# EAGLE design senseBox-MCU_v11 (EAGLE 7.7.0)

## Sheet 1 of 4
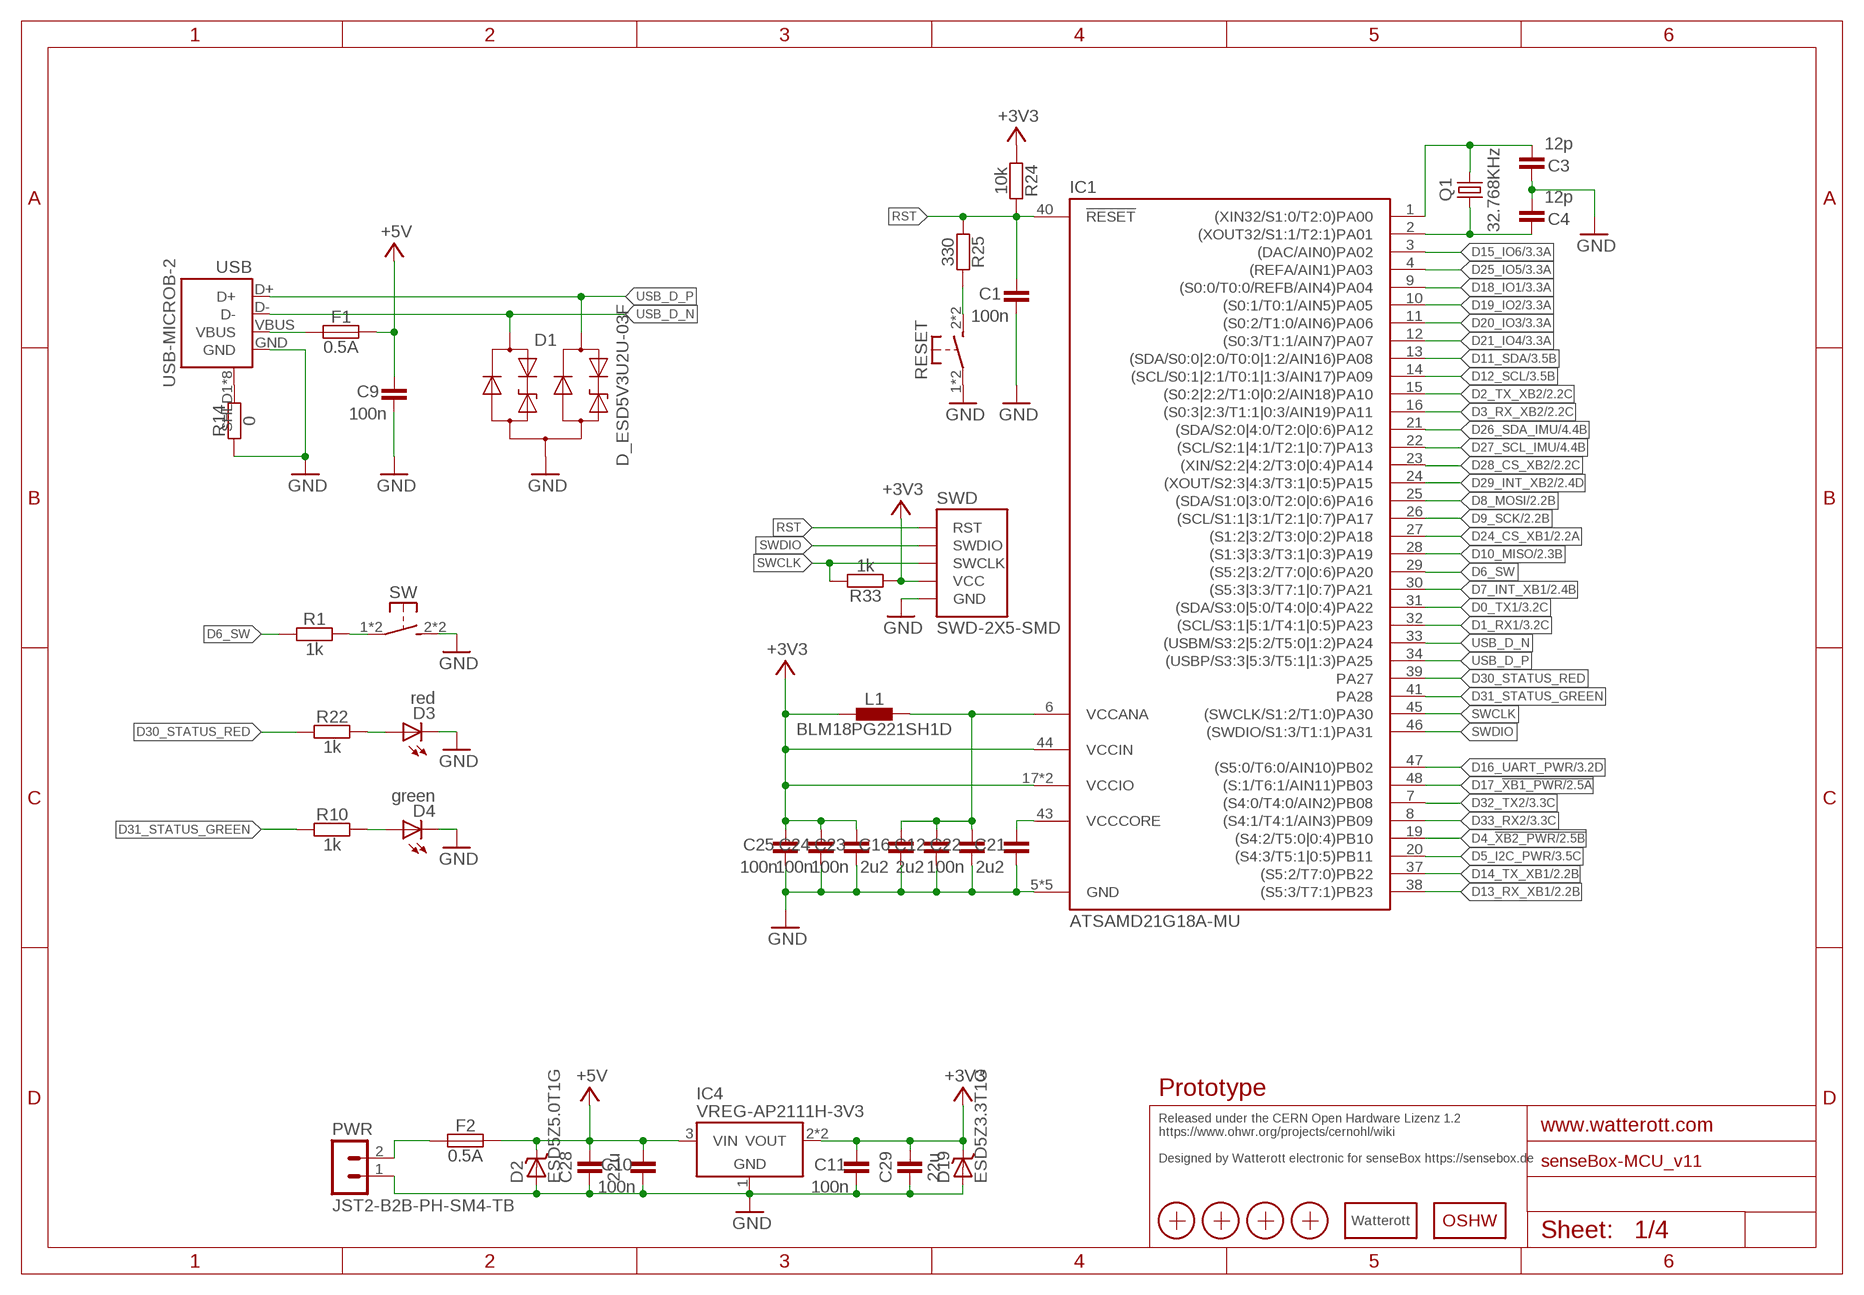
[diagram p0: schematic, sheet 1]

### Parts
C1  100n  CAPACITOR-0402  [C0402]
C3  12p  CAPACITOR-0402  [C0402]
C4  12p  CAPACITOR-0402  [C0402]
C9  100n  CAPACITOR-0402  [C0402]
C10  100n  CAPACITOR-0402  [C0402]
C11  100n  CAPACITOR-0402  [C0402]
C12  2u2  CAPACITOR-0402  [C0402]
C16  2u2  CAPACITOR-0402  [C0402]
C21  2u2  CAPACITOR-0402  [C0402]
C22  100n  CAPACITOR-0402  [C0402]
C23  100n  CAPACITOR-0402  [C0402]
C24  100n  CAPACITOR-0402  [C0402]
C25  100n  CAPACITOR-0402  [C0402]
C28  22u  CAPACITOR-0805  [C0805]
C29  22u  CAPACITOR-0805  [C0805]
D1  D_ESD5V3U2U-03F  [SOT723]
D2  ESD5Z5.0T1G  D_TVS-SOD523  [SOD523]
D3  red  LED-0603  [C0603]
D4  green  LED-0603  [C0603]
D19  ESD5Z3.3T1G  D_TVS-SOD523  [SOD523]
F1  0.5A  FUSE-0805  [C0805]
F2  0.5A  FUSE-0805  [C0805]
IC1  ATSAMD21G18A-MU  [QFN48-PAD]
IC4  VREG-AP2111H-3V3  VREG-TS1117CW-3V3  [SOT223]
L1  BLM18PG221SH1D  INDUCTOR-0603  [C0603]
LOGO2  OSHW_LOGOX0070  [OSHW_6X70]
LOGO3  LOGO_SPARK-2  [SPARK_2MM]
PWR  JST2-B2B-PH-SM4-TB  [JST_B2B-PH-SM4-TB]
Q1  32.768KHz  CRYSTAL-ZM315  [CRYSTAL_ZM315]
R1  1k  RESISTOR-0402  [C0402]
R10  1k  RESISTOR-0402  [C0402]
R14  0  RESISTOR-0402  [C0402]
R22  1k  RESISTOR-0402  [C0402]
R24  10k  RESISTOR-0402  [C0402]
R25  330  RESISTOR-0402  [C0402]
R33  1k  RESISTOR-0402  [C0402]
RESET  SW-TACTILE-TL3305  [TL3305]
SW  SW-TACTILE-TL3305  [TL3305]
SWD  SWD-2X5-SMD  [SWD-2X5_SMD]
USB  USB-MICROB-2  [USB-MICROB-10118194]
X1  PASSER-07  [PASSER_07MM]
X2  PASSER-07  [PASSER_07MM]
X3  PASSER-07  [PASSER_07MM]
X4  PASSER-07  [PASSER_07MM]

### Nets
+3V3: C11.2 C23.2 C24.2 C25.2 C29.2 D19.C IC1.17(VCCIO) IC1.36(VCCIO) IC1.44(VCCIN) IC4.2(VOUT) IC4.4(VOUT) L1.1 R24.1 R33.1 SWD.VCC ; also sheet 2,3,4
+5V: C9.2 C10.2 C28.2 D2.C F1.2 F2.2 IC4.3(VIN) ; also sheet 3
D0_TX1: IC1.31((SDA/S3:0|5:0/T4:0|0:4)PA22) ; also sheet 3
D1_RX1: IC1.32((SCL/S3:1|5:1/T4:1|0:5)PA23) ; also sheet 3
D2_TX_XB2: IC1.15((S0:2|2:2/T1:0|0:2/AIN18)PA10) ; also sheet 2
D3_RX_XB2: IC1.16((S0:3|2:3/T1:1|0:3/AIN19)PA11) ; also sheet 2
D4_!XB2_PWR: IC1.19((S4:2/T5:0|0:4)PB10) ; also sheet 2
D5_I2C_PWR: IC1.20((S4:3/T5:1|0:5)PB11) ; also sheet 3
D6_SW: IC1.29((S5:2|3:2/T7:0|0:6)PA20) R1.1
D7_INT_XB1: IC1.30((S5:3|3:3/T7:1|0:7)PA21) ; also sheet 2
D8_MOSI: IC1.25((SDA/S1:0|3:0/T2:0|0:6)PA16) ; also sheet 2
D9_SCK: IC1.26((SCL/S1:1|3:1/T2:1|0:7)PA17) ; also sheet 2
D10_MISO: IC1.28((S1:3|3:3/T3:1|0:3)PA19) ; also sheet 2
D11_SDA: IC1.13((SDA/S0:0|2:0/T0:0|1:2/AIN16)PA08) ; also sheet 3
D12_SCL: IC1.14((SCL/S0:1|2:1/T0:1|1:3/AIN17)PA09) ; also sheet 3
D13_RX_XB1: IC1.38((S5:3/T7:1)PB23) ; also sheet 2
D14_TX_XB1: IC1.37((S5:2/T7:0)PB22) ; also sheet 2
D15_IO6: IC1.3((DAC/AIN0)PA02) ; also sheet 3
D16_UART_PWR: IC1.47((S5:0/T6:0/AIN10)PB02) ; also sheet 3
D17_!XB1_PWR: IC1.48((S:1/T6:1/AIN11)PB03) ; also sheet 2
D18_IO1: IC1.9((S0:0/T0:0/REFB/AIN4)PA04) ; also sheet 3
D19_IO2: IC1.10((S0:1/T0:1/AIN5)PA05) ; also sheet 3
D20_IO3: IC1.11((S0:2/T1:0/AIN6)PA06) ; also sheet 3
D21_IO4: IC1.12((S0:3/T1:1/AIN7)PA07) ; also sheet 3
D24_CS_XB1: IC1.27((S1:2|3:2/T3:0|0:2)PA18) ; also sheet 2
D25_IO5: IC1.4((REFA/AIN1)PA03) ; also sheet 3
D26_SDA_IMU: IC1.21((SDA/S2:0|4:0/T2:0|0:6)PA12) ; also sheet 4
D27_SCL_IMU: IC1.22((SCL/S2:1|4:1/T2:1|0:7)PA13) ; also sheet 4
D28_CS_XB2: IC1.23((XIN/S2:2|4:2/T3:0|0:4)PA14) ; also sheet 2
D29_INT_XB2: IC1.24((XOUT/S2:3|4:3/T3:1|0:5)PA15) ; also sheet 2
D30_STATUS_RED: IC1.39(PA27) R22.1
D31_STATUS_GREEN: IC1.41(PA28) R10.1
D32_TX2: IC1.7((S4:0/T4:0/AIN2)PB08) ; also sheet 3
D33_RX2: IC1.8((S4:1/T4:1/AIN3)PB09) ; also sheet 3
GND: C1.1 C3.2 C4.1 C9.1 C10.1 C11.1 C12.1 C16.1 C21.1 C22.1 C23.1 C24.1 C25.1 C28.1 C29.1 D1.3(A) D2.A D3.C D4.C D19.A IC1.5(GND) IC1.18(GND) IC1.35(GND) IC1.42(GND) IC1.TP(GND) IC4.1(GND) PWR.1 R14.1 RESET.1 RESET.4(P1) SW.2(S1) SW.3(S1) SWD.GND@1(GND) SWD.GND@2(GND) SWD.GND@3(GND) USB.GND ; also sheet 2,3,4
N$1: C3.1 IC1.1((XIN32/S1:0/T2:0)PA00) Q1.2
N$2: C4.2 IC1.2((XOUT32/S1:1/T2:1)PA01) Q1.1
N$3: D3.A R22.2
N$4: F2.1 PWR.2
N$12: D4.A R10.2
N$13: R25.2 RESET.2(S1) RESET.3(S1)
RST: C1.2 IC1.40(!RESET) R24.2 R25.1 SWD.RST
SHLD: R14.2 USB.SHLD1(SHIELD) USB.SHLD2(SHIELD) USB.SHLD3(SHIELD) USB.SHLD4(SHIELD) USB.SHLD5(SHIELD) USB.SHLD6(SHIELD) USB.SHLD7(SHIELD) USB.SHLD8(SHIELD)
SW: R1.2 SW.1 SW.4(P1)
SWCLK: IC1.45((SWCLK/S1:2/T1:0)PA30) R33.2 SWD.SWCLK
SWDIO: IC1.46((SWDIO/S1:3/T1:1)PA31) SWD.SWDIO
USB_D_N [USB]: D1.1(C1) IC1.33((USBM/S3:2|5:2/T5:0|1:2)PA24) USB.D-
USB_D_P [USB]: D1.2(C2) IC1.34((USBP/S3:3|5:3/T5:1|1:3)PA25) USB.D+
VBUS: F1.1 USB.VBUS
VCCANA: C12.2 C16.2 C22.2 IC1.6(VCCANA) L1.2
VCCCORE: C21.2 IC1.43(VCCCORE)

### Notes on the sheet
- Prototype
- Released under the CERN Open Hardware Lizenz 1.2
  https://www.ohwr.org/projects/cernohl/wiki
  
  Designed by Watterott electronic for senseBox https://sensebox.de

## Sheet 2 of 4
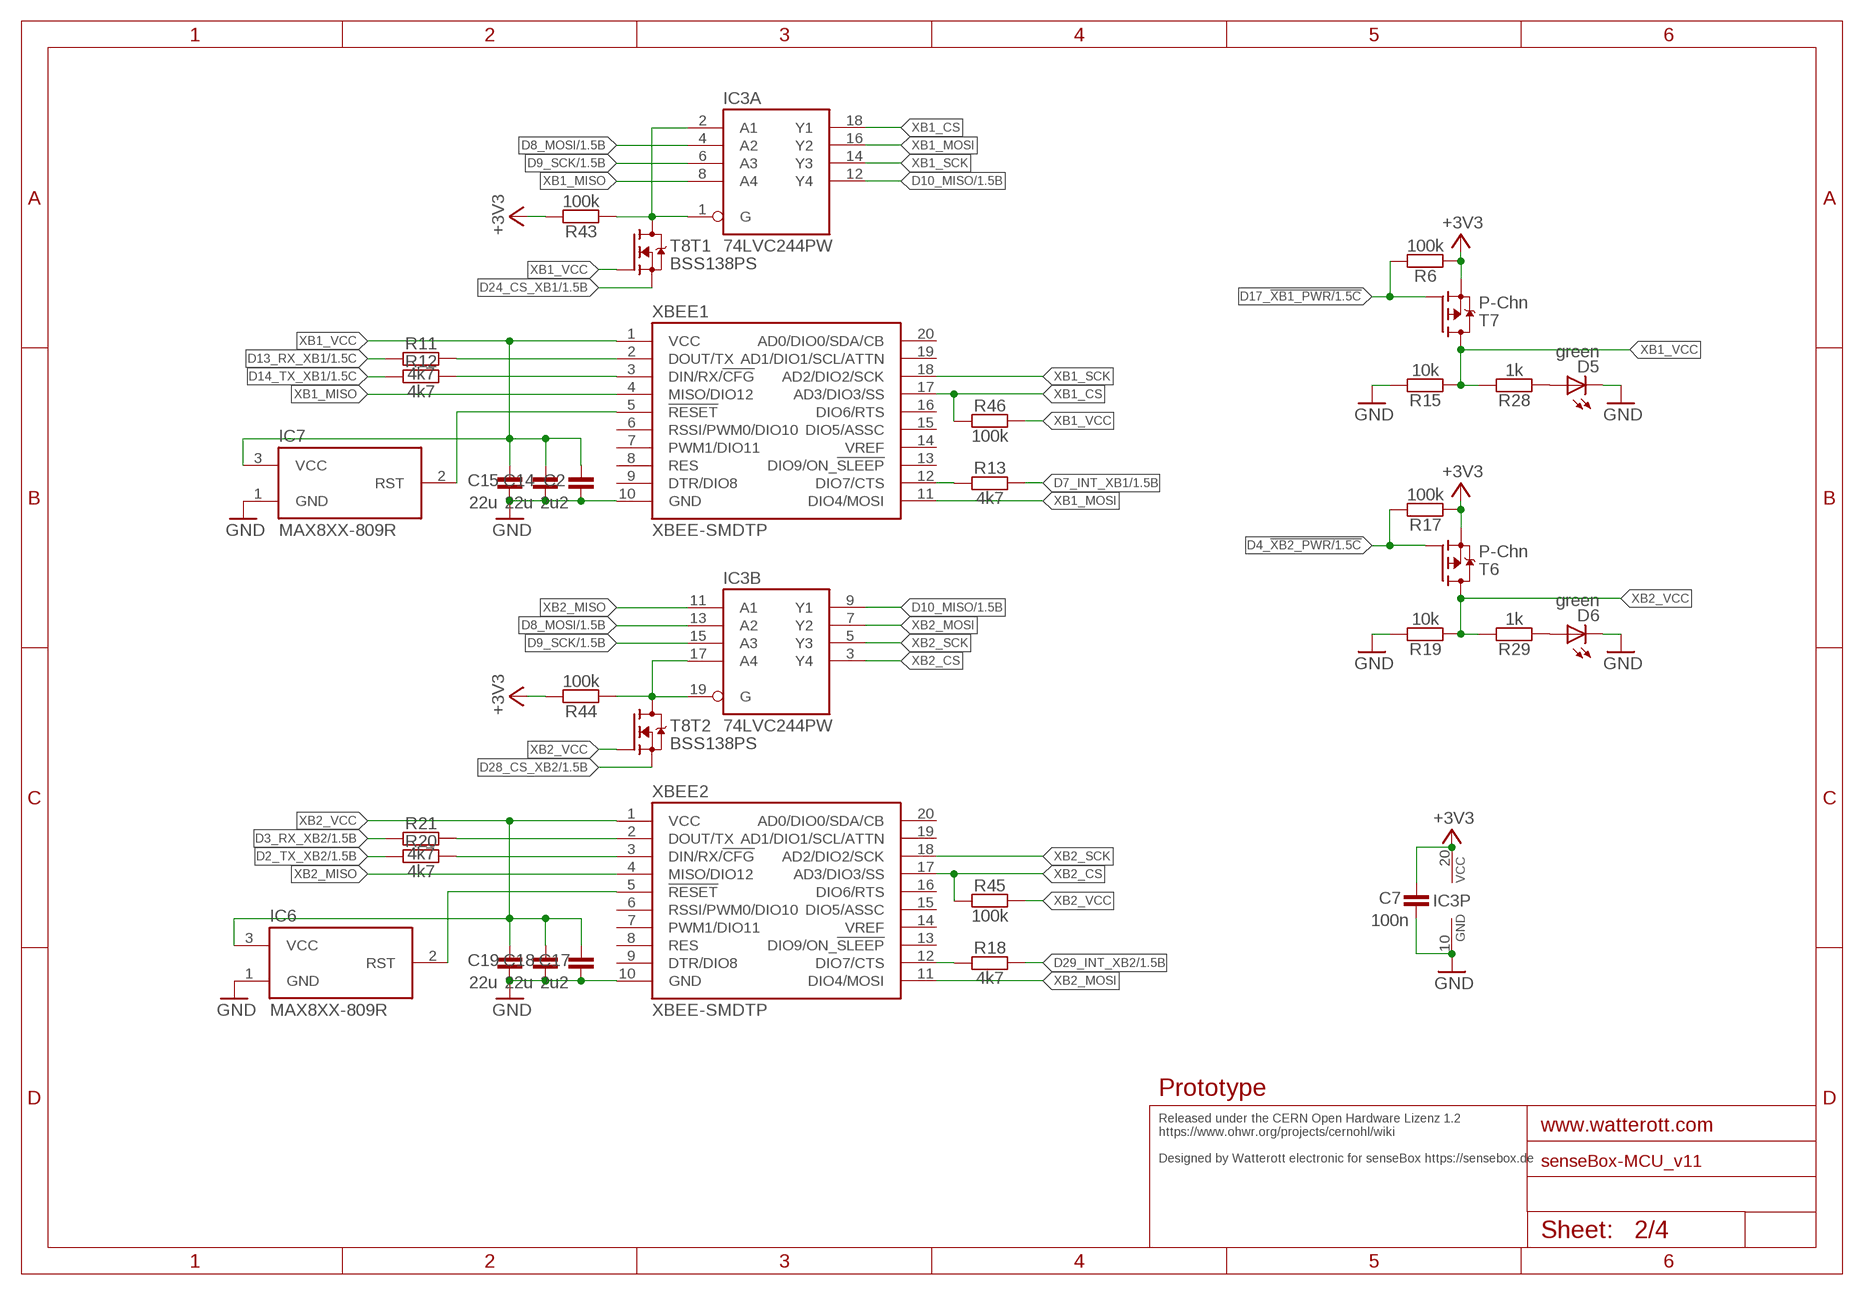
[diagram p1: schematic, sheet 2]

### Parts
C2  2u2  CAPACITOR-0402  [C0402]
C7  100n  CAPACITOR-0402  [C0402]
C14  22u  CAPACITOR-0805  [C0805]
C15  22u  CAPACITOR-0805  [C0805]
C17  2u2  CAPACITOR-0402  [C0402]
C18  22u  CAPACITOR-0805  [C0805]
C19  22u  CAPACITOR-0805  [C0805]
D5  green  LED-0603  [C0603]
D6  green  LED-0603  [C0603]
IC3  74LVC244PW  [TSSOP20]
IC6  MAX8XX-809R  [SOT23]
IC7  MAX8XX-809R  [SOT23]
R6  100k  RESISTOR-0402  [C0402]
R11  4k7  RESISTOR-0402  [C0402]
R12  4k7  RESISTOR-0402  [C0402]
R13  4k7  RESISTOR-0402  [C0402]
R15  10k  RESISTOR-0402  [C0402]
R17  100k  RESISTOR-0402  [C0402]
R18  4k7  RESISTOR-0402  [C0402]
R19  10k  RESISTOR-0402  [C0402]
R20  4k7  RESISTOR-0402  [C0402]
R21  4k7  RESISTOR-0402  [C0402]
R28  1k  RESISTOR-0402  [C0402]
R29  1k  RESISTOR-0402  [C0402]
R43  100k  RESISTOR-0402  [C0402]
R44  100k  RESISTOR-0402  [C0402]
R45  100k  RESISTOR-0402  [C0402]
R46  100k  RESISTOR-0402  [C0402]
T6  P-Chn  MOSFET-P-SOT23  [SOT23]
T7  P-Chn  MOSFET-P-SOT23  [SOT23]
T8  BSS138PS  [SOT363]
XBEE1  XBEE-SMDTP  [XBEE_SMD_TP]
XBEE2  XBEE-SMDTP  [XBEE_SMD_TP]

### Nets
+3V3: C7.2 IC3.20(P:VCC) R6.1 R17.1 R43.2 R44.2 T6.2(S) T7.2(S) ; also sheet 1,3,4
D2_TX_XB2: R20.1 ; also sheet 1
D3_RX_XB2: R21.1 ; also sheet 1
D4_!XB2_PWR: R17.2 T6.1(G) ; also sheet 1
D7_INT_XB1: R13.2 ; also sheet 1
D8_MOSI: IC3.4(A:A2) IC3.13(B:A2) ; also sheet 1
D9_SCK: IC3.6(A:A3) IC3.15(B:A3) ; also sheet 1
D10_MISO: IC3.9(B:Y1) IC3.12(A:Y4) ; also sheet 1
D13_RX_XB1: R11.1 ; also sheet 1
D14_TX_XB1: R12.1 ; also sheet 1
D17_!XB1_PWR: R6.2 T7.1(G) ; also sheet 1
D24_CS_XB1: T8.1(T1:S) ; also sheet 1
D28_CS_XB2: T8.4(T2:S) ; also sheet 1
D29_INT_XB2: R18.2 ; also sheet 1
GND: C2.1 C7.1 C14.1 C15.1 C17.1 C18.1 C19.1 D5.C D6.C IC3.10(P:GND) IC6.1(GND) IC7.1(GND) R15.2 R19.2 XBEE1.10(GND) XBEE2.10(GND) ; also sheet 1,3,4
MCU_CS_XBEE1: IC3.1(A:G) IC3.2(A:A1) R43.1 T8.6(T1:D)
MCU_CS_XBEE2: IC3.17(B:A4) IC3.19(B:G) R44.1 T8.3(T2:D)
N$5: D5.A R28.1
N$6: D6.A R29.1
RST_XB1: IC7.2(RST) XBEE1.5(!RESET!)
RST_XB2: IC6.2(RST) XBEE2.5(!RESET!)
XB1_CS: IC3.18(A:Y1) R46.1 XBEE1.17(AD3/DIO3/SS)
XB1_MISO: IC3.8(A:A4) XBEE1.4(MISO/DIO12)
XB1_MOSI: IC3.16(A:Y2) XBEE1.11(DIO4/MOSI)
XB1_RX: R12.2 XBEE1.3(DIN/RX/!CFG!)
XB1_SCK: IC3.14(A:Y3) XBEE1.18(AD2/DIO2/SCK)
XB1_TX: R11.2 XBEE1.2(DOUT/TX)
XB1_VCC: C2.2 C14.2 C15.2 IC7.3(VCC) R15.1 R28.2 R46.2 T7.3(D) T8.2(T1:G) XBEE1.1(VCC)
XB2_CS: IC3.3(B:Y4) R45.1 XBEE2.17(AD3/DIO3/SS)
XB2_MISO: IC3.11(B:A1) XBEE2.4(MISO/DIO12)
XB2_MOSI: IC3.7(B:Y2) XBEE2.11(DIO4/MOSI)
XB2_RX: R20.2 XBEE2.3(DIN/RX/!CFG!)
XB2_SCK: IC3.5(B:Y3) XBEE2.18(AD2/DIO2/SCK)
XB2_TX: R21.2 XBEE2.2(DOUT/TX)
XB2_VCC: C17.2 C18.2 C19.2 IC6.3(VCC) R19.1 R29.2 R45.2 T6.3(D) T8.5(T2:G) XBEE2.1(VCC)
XBEE1_CTS/IRQ: R13.1 XBEE1.12(DIO7/CTS)
XBEE2_CTS/IRQ: R18.1 XBEE2.12(DIO7/CTS)
Unconnected: XBEE1.6(RSSI/PWM0/DIO10) XBEE1.7(PWM1/DIO11) XBEE1.8(RES) XBEE1.9(DTR/DIO8) XBEE1.13(DIO9/ON_!SLEEP!) XBEE1.14(VREF) XBEE1.15(DIO5/ASSC) XBEE1.16(DIO6/RTS) XBEE1.19(AD1/DIO1/SCL/ATTN) XBEE1.20(AD0/DIO0/SDA/CB) XBEE2.6(RSSI/PWM0/DIO10) XBEE2.7(PWM1/DIO11) XBEE2.8(RES) XBEE2.9(DTR/DIO8) XBEE2.13(DIO9/ON_!SLEEP!) XBEE2.14(VREF) XBEE2.15(DIO5/ASSC) XBEE2.16(DIO6/RTS) XBEE2.19(AD1/DIO1/SCL/ATTN) XBEE2.20(AD0/DIO0/SDA/CB)

### Notes on the sheet
- Prototype
- Released under the CERN Open Hardware Lizenz 1.2
  https://www.ohwr.org/projects/cernohl/wiki
  
  Designed by Watterott electronic for senseBox https://sensebox.de

## Sheet 3 of 4
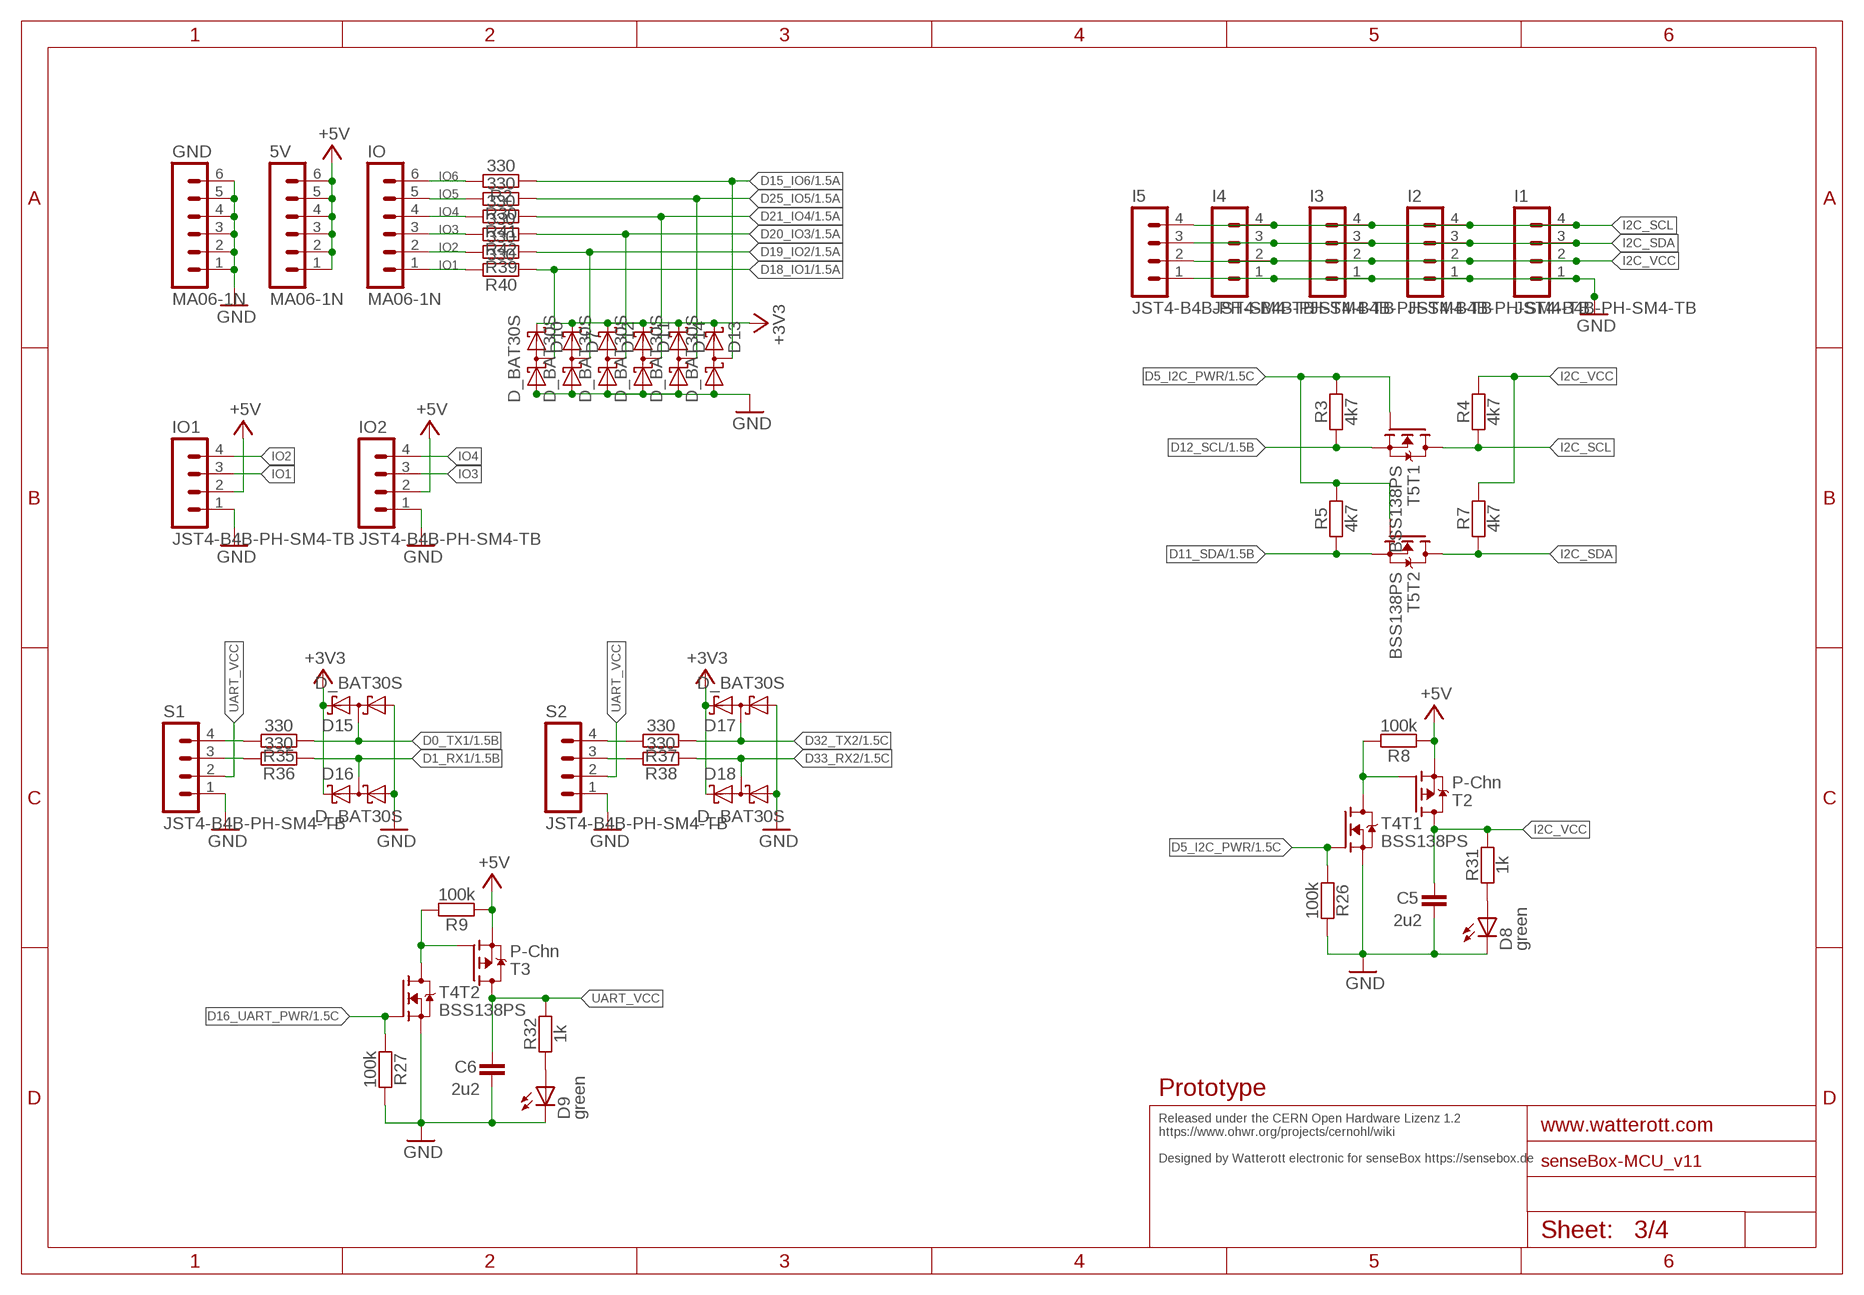
[diagram p2: schematic, sheet 3]

### Parts
5V  MA06-1N  [MA06-1_N]
C5  2u2  CAPACITOR-0402  [C0402]
C6  2u2  CAPACITOR-0402  [C0402]
D7  D_BAT30S  [SOT323]
D8  green  LED-0603  [C0603]
D9  green  LED-0603  [C0603]
D10  D_BAT30S  [SOT323]
D11  D_BAT30S  [SOT323]
D12  D_BAT30S  [SOT323]
D13  D_BAT30S  [SOT323]
D14  D_BAT30S  [SOT323]
D15  D_BAT30S  [SOT323]
D16  D_BAT30S  [SOT323]
D17  D_BAT30S  [SOT323]
D18  D_BAT30S  [SOT323]
GND  MA06-1N  [MA06-1_N]
I1  JST4-B4B-PH-SM4-TB  [JST_B4B-PH-SM4-TB]
I2  JST4-B4B-PH-SM4-TB  [JST_B4B-PH-SM4-TB]
I3  JST4-B4B-PH-SM4-TB  [JST_B4B-PH-SM4-TB]
I4  JST4-B4B-PH-SM4-TB  [JST_B4B-PH-SM4-TB]
I5  JST4-B4B-PH-SM4-TB  [JST_B4B-PH-SM4-TB]
IO  MA06-1N  [MA06-1_N]
IO1  JST4-B4B-PH-SM4-TB  [JST_B4B-PH-SM4-TB]
IO2  JST4-B4B-PH-SM4-TB  [JST_B4B-PH-SM4-TB]
R2  330  RESISTOR-0402  [C0402]
R3  4k7  RESISTOR-0402  [C0402]
R4  4k7  RESISTOR-0402  [C0402]
R5  4k7  RESISTOR-0402  [C0402]
R7  4k7  RESISTOR-0402  [C0402]
R8  100k  RESISTOR-0402  [C0402]
R9  100k  RESISTOR-0402  [C0402]
R26  100k  RESISTOR-0402  [C0402]
R27  100k  RESISTOR-0402  [C0402]
R30  330  RESISTOR-0402  [C0402]
R31  1k  RESISTOR-0402  [C0402]
R32  1k  RESISTOR-0402  [C0402]
R35  330  RESISTOR-0402  [C0402]
R36  330  RESISTOR-0402  [C0402]
R37  330  RESISTOR-0402  [C0402]
R38  330  RESISTOR-0402  [C0402]
R39  330  RESISTOR-0402  [C0402]
R40  330  RESISTOR-0402  [C0402]
R41  330  RESISTOR-0402  [C0402]
R42  330  RESISTOR-0402  [C0402]
S1  JST4-B4B-PH-SM4-TB  [JST_B4B-PH-SM4-TB]
S2  JST4-B4B-PH-SM4-TB  [JST_B4B-PH-SM4-TB]
T2  P-Chn  MOSFET-P-SOT23  [SOT23]
T3  P-Chn  MOSFET-P-SOT23  [SOT23]
T4  BSS138PS  [SOT363]
T5  BSS138PS  [SOT363]

### Nets
!I2C_POWER: R8.2 T2.1(G) T4.6(T1:D)
!UART_POWER: R9.2 T3.1(G) T4.3(T2:D)
+3V3: D7.2(C) D10.2(C) D11.2(C) D12.2(C) D13.2(C) D14.2(C) D15.2(C) D16.2(C) D17.2(C) D18.2(C) ; also sheet 1,2,4
+5V: 5V.1 5V.2 5V.3 5V.4 5V.5 5V.6 IO1.2 IO2.2 R8.1 R9.1 T2.2(S) T3.2(S) ; also sheet 1
D0_TX1: D15.3(CA) R35.1 ; also sheet 1
D1_RX1: D16.3(CA) R36.1 ; also sheet 1
D5_I2C_PWR: R3.2 R5.2 R26.1 T4.2(T1:G) T5.2(T1:G) T5.5(T2:G) ; also sheet 1
D11_SDA: R5.1 T5.4(T2:S) ; also sheet 1
D12_SCL: R3.1 T5.1(T1:S) ; also sheet 1
D15_IO6: D13.3(CA) R2.1 ; also sheet 1
D16_UART_PWR: R27.1 T4.5(T2:G) ; also sheet 1
D18_IO1: D10.3(CA) R40.1 ; also sheet 1
D19_IO2: D7.3(CA) R39.1 ; also sheet 1
D20_IO3: D12.3(CA) R42.1 ; also sheet 1
D21_IO4: D11.3(CA) R41.1 ; also sheet 1
D25_IO5: D14.3(CA) R30.1 ; also sheet 1
D32_TX2: D17.3(CA) R37.1 ; also sheet 1
D33_RX2: D18.3(CA) R38.1 ; also sheet 1
GND: C5.1 C6.1 D7.1(A) D8.C D9.C D10.1(A) D11.1(A) D12.1(A) D13.1(A) D14.1(A) D15.1(A) D16.1(A) D17.1(A) D18.1(A) GND.1 GND.2 GND.3 GND.4 GND.5 GND.6 I1.1 I2.1 I3.1 I4.1 I5.1 IO1.1 IO2.1 R26.2 R27.2 S1.1 S2.1 T4.1(T1:S) T4.4(T2:S) ; also sheet 1,2,4
I2C_SCL: I1.4 I2.4 I3.4 I4.4 I5.4 R4.1 T5.6(T1:D)
I2C_SDA: I1.3 I2.3 I3.3 I4.3 I5.3 R7.1 T5.3(T2:D)
I2C_VCC: C5.2 I1.2 I2.2 I3.2 I4.2 I5.2 R4.2 R7.2 R31.2 T2.3(D)
IO1: IO1.3 IO.1 R40.2
IO2: IO1.4 IO.2 R39.2
IO3: IO2.3 IO.3 R42.2
IO4: IO2.4 IO.4 R41.2
IO5: IO.5 R30.2
IO6: IO.6 R2.2
N$8: D8.A R31.1
N$9: D9.A R32.1
UART_RX1: R36.2 S1.3
UART_RX2: R38.2 S2.3
UART_TX1: R35.2 S1.4
UART_TX2: R37.2 S2.4
UART_VCC: C6.2 R32.2 S1.2 S2.2 T3.3(D)

### Notes on the sheet
- Prototype
- Released under the CERN Open Hardware Lizenz 1.2
  https://www.ohwr.org/projects/cernohl/wiki
  
  Designed by Watterott electronic for senseBox https://sensebox.de

## Sheet 4 of 4
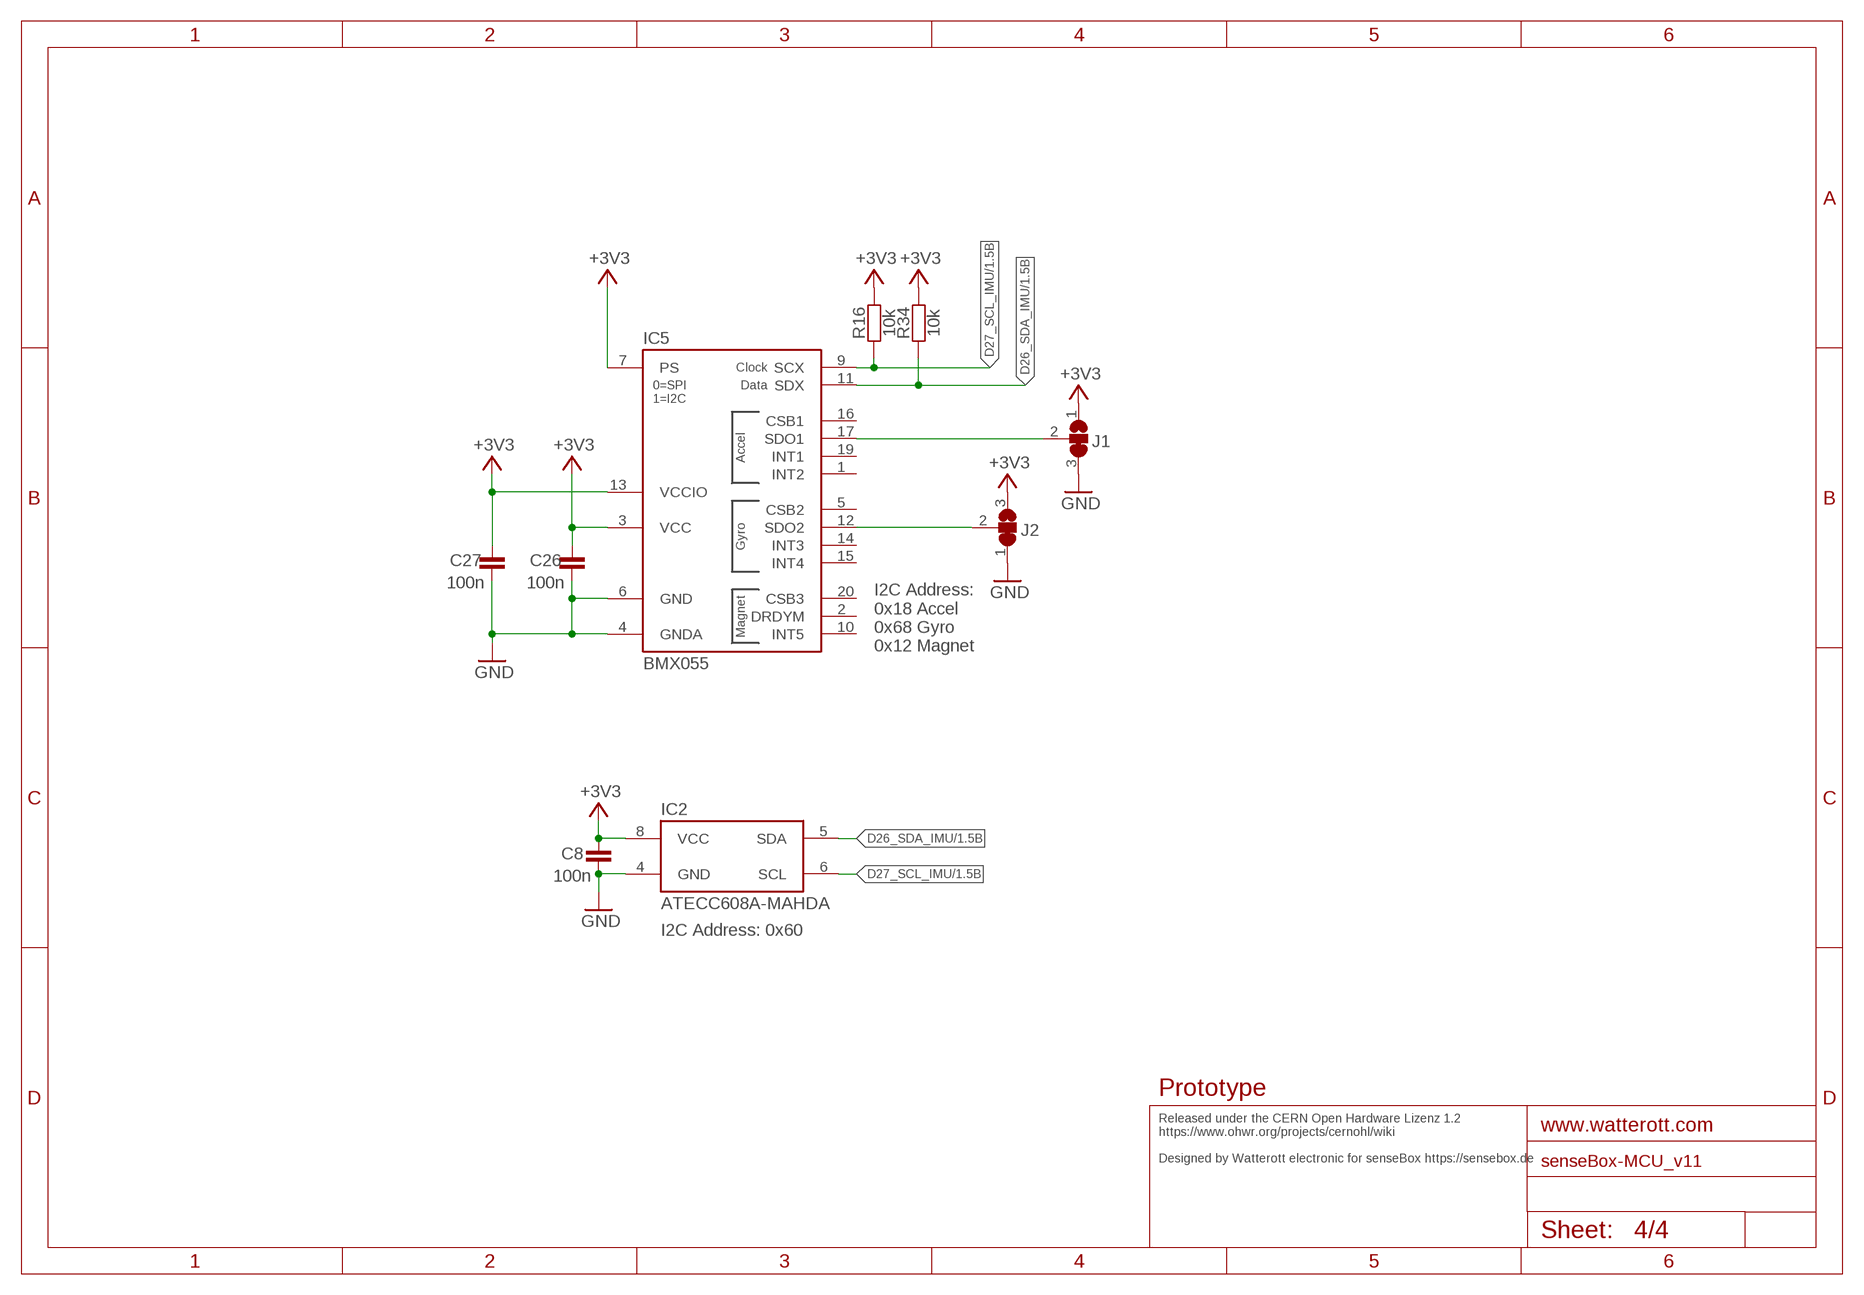
[diagram p3: schematic, sheet 4]

### Parts
C8  100n  CAPACITOR-0402  [C0402]
C26  100n  CAPACITOR-0402  [C0402]
C27  100n  CAPACITOR-0402  [C0402]
IC2  ATECC608A-MAHDA  ATECC508A-MAHDA  [UDFN8]
IC5  BMX055  [BMX055]
J1  JUMPER3-0402  [JUMPER3-0402]
J2  JUMPER3-0402  [JUMPER3-0402]
R16  10k  RESISTOR-0402  [C0402]
R34  10k  RESISTOR-0402  [C0402]

### Nets
+3V3: C8.2 C26.2 C27.2 IC2.8(VCC) IC5.3(VCC) IC5.7(PS) IC5.13(VCCIO) J1.1 J2.3 R16.2 R34.2 ; also sheet 1,2,3
D26_SDA_IMU: IC2.5(SDA) IC5.11(SDX) R34.1 ; also sheet 1
D27_SCL_IMU: IC2.6(SCL) IC5.9(SCX) R16.1 ; also sheet 1
GND: C8.1 C26.1 C27.1 IC2.4(GND) IC5.4(GNDA) IC5.6(GND) J1.3 J2.1 ; also sheet 1,2,3
SDO1: IC5.17(SDO1) J1.2
SDO2: IC5.12(SDO2) J2.2
Unconnected: IC5.1(INT2) IC5.2(DRDYM) IC5.5(CSB2) IC5.10(INT5) IC5.14(INT3) IC5.15(INT4) IC5.16(CSB1) IC5.19(INT1) IC5.20(CSB3)

### Notes on the sheet
- I2C Address:
  0x18 Accel 
  0x68 Gyro  
  0x12 Magnet
- I2C Address: 0x60
- Prototype
- Released under the CERN Open Hardware Lizenz 1.2
  https://www.ohwr.org/projects/cernohl/wiki
  
  Designed by Watterott electronic for senseBox https://sensebox.de

## Library data of the parts
5V GND IO = we-con:MA06-1: Pin Header
C1-C12 C14-C19 C21-C29 = we-rcl:CAPACITOR: Capacitors ...2.2uF @ 6.3V -> 0402 ...4.7uF @ 6.3V -> 0603 ...10uF @ 16V -> 0805 ...22uF @ 25V -> 1206
D1 = we-rcl:D_ESD5V3U2U: TVS Diode - Uni-directional Ultra Low ESD / Transient Protection Diode Vrwm=5.3V, 0.4pF@1MHz; DIGIKEY: ESD5V3U2U-03F H6327DKR-ND
D2 D19 = we-rcl:D_TVS: TVS Diodes (Transient Voltage Suppressor Diodes)
D3-D6 D8 D9 = we-opto:LED: LEDs red, green, blue -> 0603
D7 D10-D18 = we-rcl:D_BAT30S: Schottky Diode Array (1x series) If=300mA, Vf=0.5V, Vr=30V, 22pF@1MHz
F1 F2 = we-rcl:FUSE: Fuses Polyfuses 0805 - 0.5A or 1A, 6V 1206 - 2A, 6V 1812 - 1A or 2A, 16V
I1-I5 IO1 IO2 S1 S2 = we-con:JST4: JST Connector
IC1 = we-chip:ATSAMD21G: Microchip ATSAMD21Gxx ARM Cortex-M0+ (48 pin) ...18 - 256kb Flash 32kb RAM ...17 - 128kb Flash 16kb RAM ...16 - 64kb Flash 8kb RAM ...15 - 32kb Flash 4kb RAM
IC2 = we-chip:ATECC508A: Microchip ATECC508A/ATECC608A Crypto-Authentication Device ATECC508A - RNG, ECC P256 (ECDH and ECDSA), SHA256 ATECC608A - RNG, ECC P256 (ECDH and ECDSA), SHA256, AES-CCM
IC3 = we-chip:74*244: 74*244 Octal Buffer and Line Driver (3-State) HC - VCC: 2-5.5V - Input: High 2.1V @ 3V / 3.5V @ 5V AHC - VCC: 2-5.5V - Input: 5V tolerant, High 2.1V @ 3V / 3.5V @ 5V HCT - VCC: 4.5-5.5V - Input: High 2V @ 5V AHCT - VCC: 4.5-5.5V - Input: High 2V @ 5V LVC - VCC: 1.65-3.6V - Input: 5V tolerant, High 2V @ 3V; DIGIKEY: 568-1583-2-ND
IC4 = we-power:VREG: Voltage Regulators (LDOs, Switching Converters...) LDOs Taiwan Semi TS1117 800mA max 15V - compatible On Semi NCP1117 1A max 20V - compatible Diodes AP2111H 0.6A max 6V (0.25V@0.6A) - compatible Diodes AP2114H 1A max 6V (0.45V@1A) Taiwan Semi TS9011 250mA max 12V - compatible Diodes AP2210 300mA max 15V - compatible Microchip MCP1700 250mA max 6.5V - compatible Microchip MCP1702 250mA max 13V - compatible Microchip MCP1703 250mA max 16V - compatible Microchip MCP1754 150mA max 16V Taiwan Semi TS5204 150mA max 16V (low noise) DC/DC Converter Modules Recom R-78Ex.x-1.0-W36 1A max 28V - compatible CUI V78xx-2000 2A max 18V Murata OKI-78SR-x.x/1.5-W36 1.5A max 36V
IC5 = we-sensor:BMX055: Bosch BMX055 Absolute Orientation Sensor (Accelerometer, Gyroscope, Magnetometer)
IC6 IC7 = we-chip:MAX8XX: MAX8xx / STM8xx / TCM8xx Reset Monitor 809 - Active-Low, Push-Pull 810 - Active-High, Push-Pull 803 - Active-Low, Open-Drain ...R - 2.6V, mind. 140ms ...S - 2.9V, mind. 140ms ...T - 3.1V, mind. 140ms ...J - 4.0V, mind. 140ms ...M - 4.4V, mind. 140ms
J1 J2 = we-rcl:JUMPER3: 3 Pin Jumpers
L1 = we-rcl:INDUCTOR: Inductors Ferrite Bead - Murata BLM18PG 0603 3.0A 33Ohm @ 100MH -> BLM18PG330SN1D 0603 2.0A 120Ohm @ 100MH -> BLM18PG121SN1D 0603 1.4A 220Ohm @ 100MH -> BLM18PG221SH1D 0603 1.2A 330Ohm @ 100MH -> BLM18PG331SN1D 0603 1.0A 470Ohm @ 100MH -> BLM18PG471SN1D
LOGO2 = we-symbol:OSHW_LOGO: Open-Source-Hardware Logo
LOGO3 = we-symbol:LOGO_SPARK: Watterott electronic Logo
PWR = we-con:JST2: JST Connector
Q1 = we-rcl:CRYSTAL: Crystals
R1-R22 R24-R46 = we-rcl:RESISTOR: Resistors all kinds in 0402 and 0603
RESET SW = we-switch:SW-TACTILE: Tactile Switches
SWD = we-board:SWD: ARM Cortex SWD connector
T2 T3 T6 T7 = we-transistor:MOSFET-P: P-Channel MOSFET SOT23 P-Chn MOSFET TSM3401, IRLML6402 (Vds>=20V, Id>=2A + Rds<=0.1Ohm @ Vgs=4.5V)
T4 T5 T8 = we-transistor:BSS138PS: Dual N-Channel MOSFET BSS138 (Vgs>=+/-20V, Vds>=40V, Id>=0.2A + Rds<=3Ohm @ Vgs=4.5V)
USB = we-con:USB: USB Connectors; DIGIKEY: 609-4618-6-ND
X1-X4 = we-symbol:PASSER: Fiducial Markers
XBEE1 XBEE2 = we-board:XBEE: XBEE connector

## Net classes
1 USB: width 0.18 mm, clearance 0.18 mm

## Board
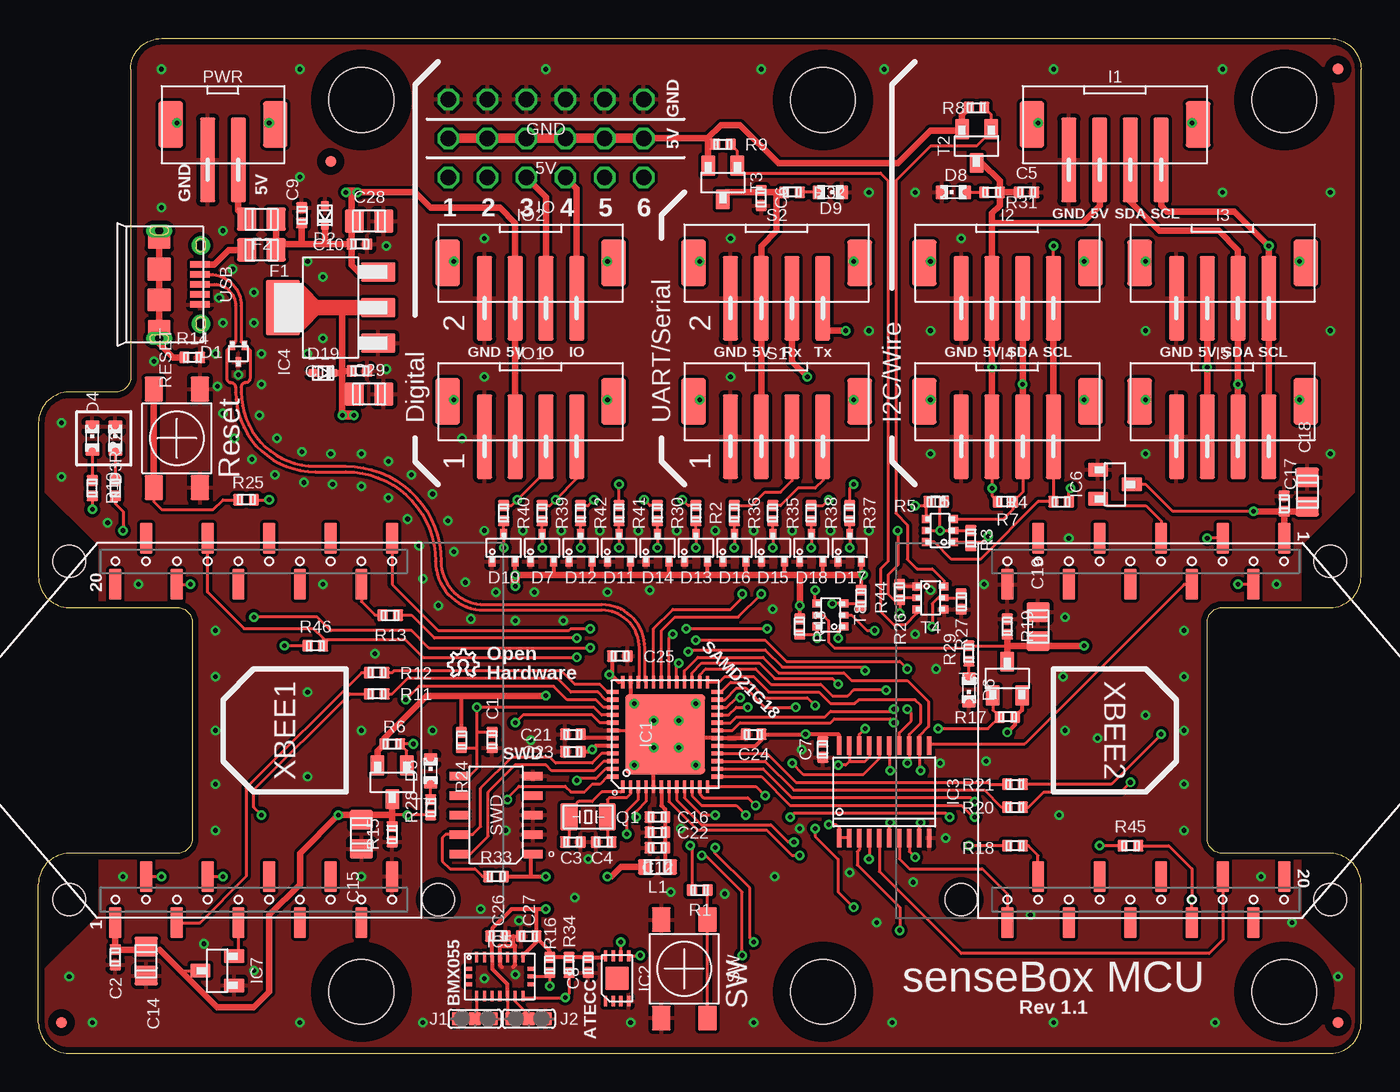
[diagram p4: board, top side]
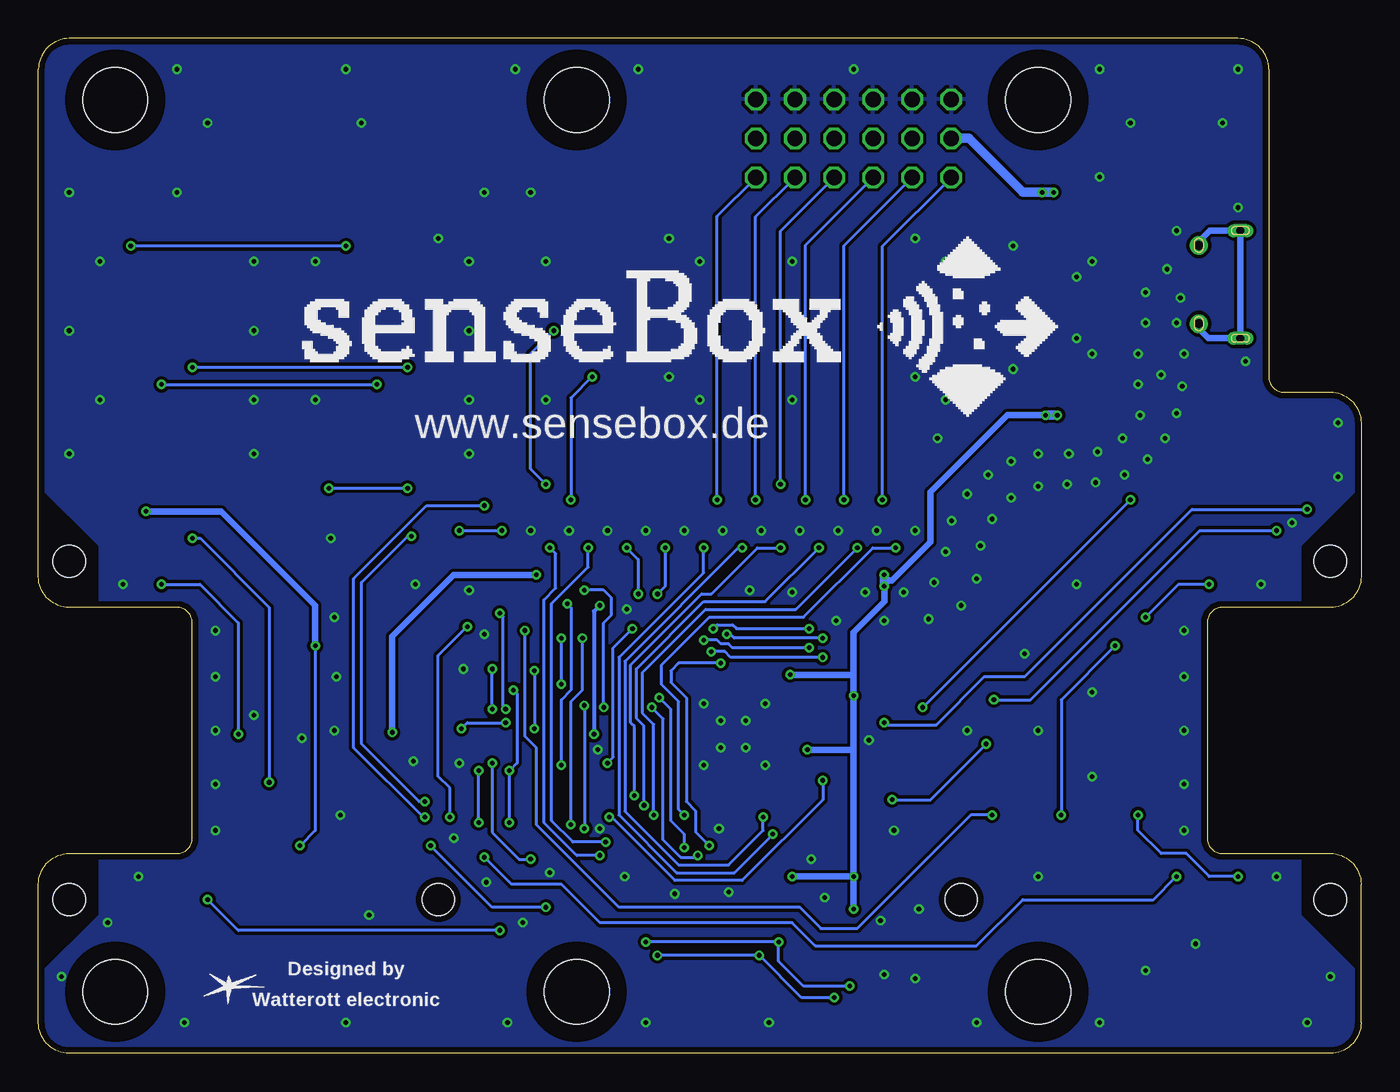
[diagram p5: board, bottom side, seen from below]

Size 86 x 66 mm. Coordinates in mm from the lower left corner, seen from the top.
Outline: 0,2 arc90 2,0 84,0 arc90 86,2 86,11 arc90 84,13 77,13 arc-90 76,14 76,28 arc-90 77,29 84,29 arc90 86,31 86,64 arc90 84,66 8,66 arc90 6,64 6,44 arc-90 5,43 2,43 arc90 0,41 0,31 arc90 2,29 9,29 arc-90 10,28 10,14 arc-90 9,13 2,13 arc90 0,11 0,2
Copper layers (1*16): Top 0.035mm / dielectric 1.5mm / Bottom 0.035mm
Design rules "we-dru-2-layer *": minimum track width 0.15mm, minimum drill 0.3mm, track to track 0.15mm, track to pad 0.15mm, pad to pad 0.15mm, via to via 0.15mm, smd to smd 0.1mm, copper to edge 0.4mm, drill to drill 0.2mm, minimum pad ring 0.18mm, minimum via ring 0.16mm, stop-mask expansion 0.1mm, vias tented up to drill 0.5mm, thermal gap 0.25mm
Holes 4.2 mm at 21,4 81,4 51,4 21,62 81,62 51,62
Holes 2.1 mm at 2,10 26,10 2,32 84,32 84,10 60,10
tRestrict: area 18,59 to 24,65; area 48,59 to 54,65; area 78,59 to 84,65; area 78,1 to 84,7; area 48,1 to 54,7; area 18,1 to 24,7; 8 lines
bRestrict: area 18,59 to 24,65; area 48,59 to 54,65; area 78,59 to 84,65; area 18,1 to 24,7; area 48,1 to 54,7; area 78,1 to 84,7

### Footprints (pad centres in the part's own frame; a part is rotated, then mirrored left to right if it is on the bottom)
MA06-1_N = drill 1 octagon: 1 0,6.35; 2 0,3.81; 3 0,1.27; 4 0,-1.27; 5 0,-3.81; 6 0,-6.35
C0402 = smd 0.75 x 0.7: 1 0,0.5; 2 0,-0.5
C0805 = smd 1.5 x 1.25: 1 0,0.95; 2 0,-0.95
SOT723 = smd 0.6 x 0.4: 1 -0.55,0.4; 2 -0.55,-0.4; 3 0.55,0
SOD523 = smd 0.5 x 0.7: A 0,-0.6; C 0,0.6
C0603 = smd 0.9 x 0.8: A 0,-0.75; C 0,0.75
SOT323 = smd 0.6 x 0.5: 1 -0.9,0.75; 2 -0.9,-0.75; 3 0.9,0
JST_B4B-PH-SM4-TB = smd 5.5 x 1: 1 -2.9,3; 2 -2.9,1; 3 -2.9,-1; 4 -2.9,-3 | smd 3 x 1.6: SHLD1 -0.6,5.4; SHLD2 -0.6,-5.4
QFN48-PAD = smd 0.8 x 0.26: 1 -3.4,2.75; 2 -3.4,2.25; 3 -3.4,1.75; 4 -3.4,1.25; 5 -3.4,0.75; 6 -3.4,0.25; 7 -3.4,-0.25; 8 -3.4,-0.75; 9 -3.4,-1.25; 10 -3.4,-1.75; 11 -3.4,-2.25; 12 -3.4,-2.75; 25 3.4,-2.75; 26 3.4,-2.25; 27 3.4,-1.75; 28 3.4,-1.25; 29 3.4,-0.75; 30 3.4,-0.25; 31 3.4,0.25; 32 3.4,0.75; 33 3.4,1.25; 34 3.4,1.75; 35 3.4,2.25; 36 3.4,2.75 | smd 0.26 x 0.8: 13 -2.75,-3.4; 14 -2.25,-3.4; 15 -1.75,-3.4; 16 -1.25,-3.4; 17 -0.75,-3.4; 18 -0.25,-3.4; 19 0.25,-3.4; 20 0.75,-3.4; 21 1.25,-3.4; 22 1.75,-3.4; 23 2.25,-3.4; 24 2.75,-3.4; 37 2.75,3.4; 38 2.25,3.4; 39 1.75,3.4; 40 1.25,3.4; 41 0.75,3.4; 42 0.25,3.4; 43 -0.25,3.4; 44 -0.75,3.4; 45 -1.25,3.4; 46 -1.75,3.4; 47 -2.25,3.4; 48 -2.75,3.4 | smd 5.2 x 5.2: TP 0,0
UDFN8 = smd 0.7 x 0.28: 1 -1.475,0.75; 2 -1.475,0.25; 3 -1.475,-0.25; 4 -1.475,-0.75; 5 1.475,-0.75; 6 1.475,-0.25; 7 1.475,0.25; 8 1.475,0.75 | smd 1.5 x 1.5: TP 0,0
TSSOP20 = smd 1.2 x 0.35: 1 -3,2.925; 2 -3,2.275; 3 -3,1.625; 4 -3,0.975; 5 -3,0.325; 6 -3,-0.325; 7 -3,-0.975; 8 -3,-1.625; 9 -3,-2.275; 10 -3,-2.925; 11 3,-2.925; 12 3,-2.275; 13 3,-1.625; 14 3,-0.975; 15 3,-0.325; 16 3,0.325; 17 3,0.975; 18 3,1.625; 19 3,2.275; 20 3,2.925
SOT223 = smd 2.235 x 1.219: 1 -3.099,2.311; 2 -3.099,0; 3 -3.099,-2.311 | smd 2.2 x 3.6: 4 3.099,0
BMX055 = smd 0.25 x 0.675: 1 -1.5,1.262; 2 -1,1.262; 3 -0.5,1.262; 4 0,1.262; 5 0.5,1.262; 6 1,1.262; 7 1.5,1.262; 11 1.5,-1.262; 12 1,-1.262; 13 0.5,-1.262; 14 0,-1.262; 15 -0.5,-1.262; 16 -1,-1.262; 17 -1.5,-1.262 | smd 0.55 x 0.25: 8 2.05,0.5; 9 2.05,0; 10 2.05,-0.5; 18 -2.05,-0.5; 19 -2.05,0; 20 -2.05,0.5
SOT23 = smd 1.3 x 0.9: 1 -1.1,0.95; 2 -1.1,-0.95; 3 1.1,0
JUMPER3-0402 = smd 0.9 x 0.8: 1 0,1.1; 2 0,0; 3 0,-1.1
C0603' = smd 1 x 0.95: 1 0,0.8; 2 0,-0.8
JST_B2B-PH-SM4-TB = smd 5.5 x 1: 1 -2.9,1; 2 -2.9,-1 | smd 3 x 1.6: SHLD1 -0.6,3.4; SHLD2 -0.6,-3.4
CRYSTAL_ZM315 = smd 1.8 x 1.1: 1 0,1.25; 2 0,-1.25
TL3305 = smd 1.6 x 1.2: 1 -3.2,1.5; 2 -3.2,-1.5; 3 3.2,-1.5; 4 3.2,1.5
SWD-2X5_SMD = smd 1.27 x 0.533: GND@1 -2.413,1.27; GND@2 -2.413,0; GND@3 -2.413,-2.54; NC@1 -2.413,-1.27; NC@2 2.413,-1.27; RST 2.413,-2.54; SWCLK 2.413,1.27; SWDIO 2.413,2.54; SWO 2.413,0; VCC -2.413,2.54
SOT363 = smd 0.6 x 0.5: 1 -0.9,0.75; 3 -0.9,-0.75; 4 0.9,-0.75; 6 0.9,0.75 | smd 0.6 x 0.4: 2 -0.9,0; 5 0.9,0
USB-MICROB-10118194 = smd 1.3 x 0.4: D+ -2.5,0; D- -2.5,-0.65; GND -2.5,1.3; ID -2.5,0.65; VBUS -2.5,-1.3 | drill 0.6 pad 1.2: SHLD1 -2.55,2.55; SHLD2 -2.55,-2.55 | drill 0.5 pad 0.8 long: SHLD3 0.15,3.5; SHLD4 0.15,-3.5 | smd 1.5 x 1.1: SHLD5 0.15,2.85; SHLD6 0.15,-2.85 | smd 1.5 x 1.5: SHLD7 0.15,1; SHLD8 0.15,-1
PASSER_07MM = smd 0.7 x 0.7: X 0,0
XBEE_SMD_TP = smd 2 x 0.8: 1 -12.5,9; 2 -9.5,7; 3 -12.5,5; 4 -9.5,3; 5 -12.5,1; 6 -9.5,-1; 7 -12.5,-3; 8 -9.5,-5; 9 -12.5,-7; 10 -9.5,-9; 11 12.5,-9; 12 9.5,-7; 13 12.5,-5; 14 9.5,-3; 15 12.5,-1; 16 9.5,1; 17 12.5,3; 18 9.5,5; 19 12.5,7; 20 9.5,9

### Placement (x,y rotation side)
5V  33,59.5 90 top
C1  29.5,20.38 180 top
C2  5,6.25 180 top
C3  34.75,13.75 90 top
C4  36.75,13.75 90 top
C5  64.25,56 270 top
C6  47,55.62 180 top
C7  51,19.75 180 top
C8  35.75,5.75 180 top
C9  17.12,54.5 0 top
C10  20.88,52.62 270 top
C11  20.88,44.38 270 top
C12  40.25,13.38 90 top
C14  7,6 180 top
C15  21,14.25 180 top
C16  40.25,15.38 90 top
C17  81,35.75 0 top
C18  82.5,36.5 0 top
C19  65,27.75 0 top
C21  34.75,20.75 90 top
C22  40.25,14.38 90 top
C23  34.75,19.62 90 top
C24  46.5,20.75 90 top
C25  37.81,25.83 270 top
C26  29.88,7.62 270 top
C27  31.88,7.62 90 top
C28  21.5,54.12 270 top
C29  21.5,42.88 270 top
D1  13,45.5 270 top
D2  18.62,54.5 180 top
D3  5,40 0 top
D4  3.5,40 0 top
D5  25.5,18.38 0 top
D6  60.5,23.62 180 top
D7  32.75,32.88 90 top
D8  59.5,56 90 top
D9  51.5,56 270 top
D10  30.25,32.88 90 top
D11  37.75,32.88 90 top
D12  35.25,32.88 90 top
D13  42.75,32.88 90 top
D14  40.25,32.88 90 top
D15  47.75,32.88 90 top
D16  45.25,32.88 90 top
D17  52.75,32.88 90 top
D18  50.25,32.88 90 top
D19  18.5,44.25 270 top
F1  14.5,52.25 90 top
F2  14.5,54.25 90 top
GND  33,62.04 90 top
I1  70,61 90 top
I2  63,52 90 top
I3  77,52 90 top
I4  63,43 90 top
I5  77,43 90 top
IC1  40.75,20.75 90 top
IC2  37.62,4.88 90 top
IC3  55,17 90 top
IC4  19,48.5 180 top
IC5  30,5 0 top
IC6  70,37 0 top
IC7  11.62,5.38 180 top
IO  33,56.96 90 top
IO1  32,43 90 top
IO2  32,52 90 top
J1  28.38,2.25 270 top
J2  31.88,2.25 270 top
L1  BLM18PG221SH1D  [C0603']  40.25,12.12 90 top
LOGO2  26.62,24.5 0 top
LOGO3  73.62,4.38 0 bottom
PWR  12,61 90 top
Q1  35.75,15.38 270 top
R1  43,10.62 90 top
R2  42.75,35.12 180 top
R3  60.62,33.5 180 top
R4  66.5,35.88 90 top
R5  58.38,35.88 90 top
R6  23,20.12 90 top
R7  62.88,35.88 270 top
R8  61,61.5 90 top
R9  44.5,59.12 90 top
R10  3.5,36.75 180 top
R11  22,23.38 270 top
R12  22,24.75 270 top
R13  22.88,28.5 90 top
R14  10,45.25 270 top
R15  23,14.25 0 top
R16  33.25,5.75 180 top
R17  63,21.88 270 top
R18  63.5,13.5 270 top
R19  63,27.75 180 top
R20  63.5,16 90 top
R21  63.5,17.5 90 top
R22  5,36.75 180 top
R24  27.5,20.38 0 top
R25  13.5,36 270 top
R26  56,30 180 top
R27  60,29.38 0 top
R28  25.5,16 0 top
R29  60.5,26 180 top
R30  40.25,35.12 180 top
R31  62,56 90 top
R32  49,56 270 top
R33  29.75,11.5 270 top
R34  34.5,5.75 180 top
R35  47.75,35.12 180 top
R36  45.25,35.12 180 top
R37  52.75,35.12 180 top
R38  50.25,35.12 180 top
R39  32.75,35.12 180 top
R40  30.25,35.12 180 top
R41  37.75,35.12 180 top
R42  35.25,35.12 180 top
R43  49.5,27.75 180 top
R44  53.5,29.62 180 top
R45  71,13.5 270 top
R46  18,26.5 270 top
RESET  9,40 270 top
S1  48,43 90 top
S2  48,52 90 top
SW  42,5.5 270 top
SWD  29.75,15.5 180 top
T2  61,59 270 top
T3  44.5,56.62 270 top
T4  58,29.62 0 top
T5  58.62,34 180 top
T6  63,24.38 90 top
T7  23,17.62 270 top
T8  51.5,28.5 180 top
USB  8,50 180 top
X1  1.5,2 0 top
X2  19,58 0 top
X3  84.5,64 0 top
X4  84.5,2 0 top
XBEE1  14,21 90 top
XBEE2  72,21 270 top

### Tracks (layer width: path | path; a pad name or v marks a point on that pad's centre or on a via)
!I2C_POWER
  Top 0.203: R8.2 61.95,61.05 T2.1 61.95,59.92 61.92,59.92 61,59 58,59 55.75,56.75 55.75,35.12 56.5,34.38 56.5,32.12 57.12,31.5 58.12,31.5 58.9,30.73 T4.6
!UART_POWER
  Top 0.203: R9.2 45.45,58.67 T3.1 45.45,57.55 45.75,57.25 54.75,57.25 55.25,56.75 55.25,32 54.75,31.5 54.75,28.75 55.62,27.88 56.38,27.88 57.1,28.6 T4.3
+3V3  (via drill 0.3)
  Top 0.203: 30.88,2.35 J2.3 30.5,2.25 | 32.38,7.25 32.38,7.5 C27.2 | IC5.13 30.5,2.25 | J1.1 30.5,2.25 | 36.77,6.25 IC2.8 | SWD.VCC 32.09,12.96 32,12.88 | 37.25,24.62 37.31,24.57 | 53.38,30.12 R44.2
  Top 0.254: R33.1 32,11.5 | R43.2 v49.5,29.12 | v31,31.12 D10.2 | 36,31.12 D12.2 | 38.5,31.12 D11.2 | 41,31.12 D14.2 | 43.5,31.12 D13.2 | 46,31.12 D16.2 | 48.5,31.12 D15.2 | 51,31.12 D18.2 | IC5.13 30.5,4.5 29.5,5.5 IC5.3 29.5,7.5 | IC5.7 31.5,6.38 32.38,7.25 | 29.5,7.5 C26.2 | 36.77,6.25 C8.2 R34.2 R16.2 33.25,6.62 32.38,7.5 | D7.2 33.5,31.12 | 32,12.88 32,11.5 | R24.1 27.5,23.25 | IC1.17 46.62,20 47,20.38 C24.2 v49.88,20.75 51,20.75 | IC1.44 36.25,20 v36,19.75 35.88,19.62 C23.2 | C25.2 37.31,24.57 37.73,24.15 IC1.36 | v37.12,24.62 37.25,24.62 | R44.2 53.5,31.12 D17.2 | v63,20.88 63.5,21.38 R17.1 63.95,22.32 T6.2 | IC3.20 52.08,20.68 52,20.75 51,20.75 | C7.2 51,20.75 | C27.2 32.38,9.38 | 32.38,9.38 30.75,9.38 29.5,8.12 29.5,7.5 | 32,11.5 v33,11.5 | v33,9.38 32.38,9.38
  Top 0.406: T7.2 22.05,19.68 R6.1 22.5,20.5 25.25,23.25 27.5,23.25 v33,23.25 | v31,31.12 33.5,31.12 36,31.12 38.5,31.12 41,31.12 43.5,31.12 46,31.12 48.5,31.12 49.5,31.12 | 49.5,31.12 51,31.12 53.5,31.12 v53.62,31.12 | 19.75,48.5 19.75,44.38 | 19.75,44.38 19.75,44.25 | 19.75,44.25 19.75,42.88 | 19.75,42.88 v19.75,41.5 | D19.C 19.75,44.25 | C11.2 19.75,44.38 | C29.2 19.75,42.88 | v37,11.5 37.25,11.5 37.88,12.12 L1.1 | 49.5,31.12 v49.5,29.12
  Top 0.61: v31,30.38 v31,31.12 | v20.5,41.5 v19.75,41.5
  Top 1.016: IC4.2 19.75,48.5 18,48.5 | 18,48.5 17,49.5 17,47.5 18,48.5 | 18,48.5 IC4.4
  Bottom 0.254: v49.5,29.12 49.88,28.75 v49.88,20.75
  Bottom 0.406: v33,11.5 33,19.75 | 33,19.75 v33,23.25 33,24.62 | 33,24.62 33,27.38 31,29.38 v31,30.38 | v37.12,24.62 33,24.62 | v36,19.75 33,19.75 | v20.5,41.5 23,41.5 28,36.5 28,33.25 30.5,30.75 31,30.75 | v33,11.5 v37,11.5 | v53.62,31.12 59,31.12 63,27.12 v63,20.88 | v33,11.5 v33,9.38
  Bottom 0.61: v31,30.38 31,30.75 v31,31.12 | v19.75,41.5 v20.5,41.5
+5V  (via drill 0.3)
  Top 0.203: 59.95,60 T2.2 | 43.55,59.45 43.5,59.5 | R9.1 43.55,59.12
  Top 0.406: IO1.2 IO2.2 31,54 30,55 25.5,55 24.5,56 v20.75,56 | 5V.6 43.5,59.5 44.38,60.38 45.62,60.38 48.12,57.88 55.88,57.88 58,60 59.95,60 | T2.2 60.05,61.05 R8.1 | T3.2 43.55,59.12 43.55,59.45 | C10.2 18.5,52.62 | 18.5,52.62 17.12,52.62 | IC4.3 20.81,50.81 20.38,51.25 C10.2 | D2.C 18.62,52.75 18.5,52.62 | C10.2 20.38,53.95 C28.2 20.38,54.3 20.38,56 | C9.2 17.12,52.62 | F1.2 F2.2 15.45,52.8 15.62,52.62 17.12,52.62
  Top 0.61: 5V.1 5V.2 5V.3 5V.4 5V.5 5V.6 | v20,56 20.38,56 v20.75,56
  Bottom 0.61: v20,56 22,56 25.5,59.5 5V.1
D0_TX1  (via drill 0.3)
  Top 0.203: R35.1 D15.3 v47.75,32.88 | IC1.31 40.5,27.5 41.38,28.38 45.5,28.38 v47,29.88
  Bottom 0.203: v47.75,32.88 47,32.12 v47,29.88
D1_RX1  (via drill 0.3)
  Top 0.203: R36.1 D16.3 v45.25,32.88 | v45.75,29.88 45.75,29.62 45,28.88 41.25,28.88 40,27.62 IC1.32
  Bottom 0.203: v45.25,32.88 45.25,30.38 v45.75,29.88
D2_TX_XB2
  Top 0.203: IC1.15 47.25,19 49.12,17.12 61.5,17.12 62.62,16 R20.1
D3_RX_XB2
  Top 0.203: IC1.16 47.38,19.5 49.25,17.62 61.75,17.62 61.88,17.5 R21.1
D4_!XB2_PWR  (via drill 0.3)
  Top 0.203: IC1.19 45.12,21 45.62,21.5 51.5,21.5 51.75,21.75 55.38,21.75 v55.62,21.5 | v58.5,21.12 61.75,21.12 R17.2 62.05,22.32 T6.1
  Bottom 0.203: v58.5,21.12 58.12,21.5 v55.62,21.5
D5_I2C_PWR  (via drill 0.3)
  Top 0.203: IC1.20 45,21.5 45.38,21.88 51.12,21.88 51.5,22.25 55.5,22.25 v55.62,22.38 | R3.2 T5.2 v58.62,34 | T5.5 v58.62,34 | v58.62,34 58.62,35.62 R5.2 | T4.2 56,29.62 R26.1 | R26.1 v56,28.62 | v55.88,34 55.88,31.75 55.25,31.12 55.25,29.88 55.62,29.5 R26.1
  Bottom 0.203: v56,28.62 55.77,28.4 55.77,22.52 v55.62,22.38 | v58.62,34 v55.88,34
D6_SW  (via drill 0.3)
  Top 0.203: IC1.29 41.5,25.25 v41.62,25.38 | v42.38,13.5 42.5,13.38 R1.1
  Bottom 0.203: v42.38,13.5 43.25,14.38 43.25,15.75 43.88,16.38 43.88,23.12 44.88,24.12 44.88,24.88 44.38,25.38 v41.62,25.38
D7_INT_XB1  (via drill 0.3)
  Top 0.203: v35,27 25.75,27 24.25,28.5 R13.2 | IC1.30 41,27 v41.25,27.25
  Bottom 0.203: v35,27 40.75,27 41,27.25 v41.25,27.25
D8_MOSI  (via drill 0.3)
  Top 0.203: IC3.4 54.02,12.65 v54,12.62 | v56.5,18.88 56.62,19 IC3.13 56.62,20.75 57.38,21.5 57.38,22.62 57,23 53.34,23 53.09,22.75 51.5,22.75 50.75,23.5 47.5,23.5 46.5,24.5 44.62,24.5 44.27,24.15 IC1.25
  Bottom 0.203: v56.5,18.88 56.5,14.38 54.75,12.62 v54,12.62
D9_SCK  (via drill 0.3)
  Top 0.203: v55.12,23.62 53,23.62 52.62,23.25 51.62,23.25 50.88,24 47.62,24 46.62,25 43.38,25 43,24.62 IC1.26 | IC3.6 55.33,14.95 v55.38,15 | IC3.15 55.33,18.43 v55.38,18.38
  Bottom 0.203: v55.38,15 v55.38,18.38 54.88,18.88 54.88,23.38 v55.12,23.62
D10_MISO  (via drill 0.3)
  Top 0.203: IC1.28 42,24.88 42.88,25.75 47.12,25.75 48.12,24.75 52.38,24.75 52.88,24.25 56.5,24.25 57.88,22.88 57.88,21.25 57.27,20.65 IC3.12 57.27,18.48 v57.38,18.38 | IC3.9 57.27,14.9 v57.38,15
  Bottom 0.203: v57.38,15 v57.38,18.38
D11_SDA  (via drill 0.3)
  Top 0.203: T5.4 57.73,35.62 | 57.73,35.62 57.73,35.73 R5.1 | IC1.13 47,18 48.88,16.12 60,16.12 60.75,15.38 v60.88,15.38 | v57,35.62 57.73,35.62
  Bottom 0.203: v60.88,15.38 61,15.38 65.5,19.88 65.5,30.88 60.75,35.62 v57,35.62
D12_SCL  (via drill 0.3)
  Top 0.203: v60.88,16.38 60.62,16.62 49,16.62 47.12,18.5 IC1.14 | v61.75,33.62 61.38,33.25 60.62,33.25 R3.1 60.38,33.25 T5.1
  Bottom 0.203: v60.88,16.38 61.25,16.38 65,20.12 65,30.62 62,33.62 v61.75,33.62
D13_RX_XB1
  Top 0.203: IC1.38 36.88,23 36.38,23.5 34.62,23.5 33.75,24.38 24,24.38 23,23.38 R11.1
D14_TX_XB1
  Top 0.203: R12.1 23,24.75 23.12,24.88 34,24.88 34.88,24 36.5,24 37,23.5 IC1.37
D15_IO6  (via drill 0.3)
  Top 0.203: R2.1 D13.3 v42.75,32.88 | IC1.3 39,16.5 38.25,15.75 v38.25,14.25
  Bottom 0.203: v42.75,32.88 42.75,31.25 48.25,25.75 48.25,15.5 44.5,11.75 40.75,11.75 v38.25,14.25
D16_UART_PWR  (via drill 0.3)
  Top 0.203: v48.88,15.38 49.12,15.62 59,15.62 v59.25,15.38 | IC1.47 36.88,18.5 36.25,17.88 35.12,17.88 v35,17.75 | v58.12,27.75 58.12,29.25 58.5,29.62 T4.5 59.75,29.62 R27.1
  Bottom 0.203: v35,17.75 35,16.5 40.25,11.25 44.62,11.25 48.75,15.38 v48.88,15.38 | v59.25,15.38 59.25,17.25 60,18 60,25.88 v58.12,27.75
D17_!XB1_PWR  (via drill 0.3)
  Top 0.203: 23.57,20.06 R6.2 | T7.1 23.95,19.68 R6.2 | IC1.48 37,18 36.5,17.5 36,17.5 35.5,17 34.62,17 34.25,17.38 31.25,17.38 30.5,16.62 v30.5,16.5 | v24.38,20.12 R6.2
  Bottom 0.203: v30.5,16.5 28,16.5 v24.38,20.12
D18_IO1  (via drill 0.3)
  Top 0.203: R40.1 D10.3 v30.25,32.88 | IC1.9 42,16.62 43.12,15.5 v44,15.5
  Bottom 0.203: v30.25,32.88 31.75,32.88 36.25,28.38 42.38,28.38 45.5,25.25 45.5,24 44.38,22.88 44.38,15.88 v44,15.5
D19_IO2  (via drill 0.3)
  Top 0.203: R39.1 D7.3 v32.75,32.88 | IC1.10 42.5,16.75 43.12,16.12 45.38,16.12 v46,15.5
  Bottom 0.203: v32.75,32.88 36.75,28.88 42.62,28.88 46.75,24.75 46.75,22.15 46,21.4 v46,15.5
D20_IO3  (via drill 0.3)
  Top 0.203: R42.1 D12.3 v35.25,32.88 | IC1.11 43,16.88 43.25,16.62 46.12,16.62 v46.62,16.12
  Bottom 0.203: v35.25,32.88 38.75,29.38 42.75,29.38 47.12,25 47.12,21.79 46.62,21.29 v46.62,16.12
D21_IO4  (via drill 0.3)
  Top 0.203: R41.1 D11.3 v37.75,32.88 | IC1.12 46.65,17.35 v47.25,16.75
  Bottom 0.203: v37.75,32.88 39.25,32.88 42.25,29.88 42.88,29.88 47.5,25.25 47.5,21.5 47.25,21.25 v47.25,16.75
D24_CS_XB1  (via drill 0.3)
  Top 0.203: v52,24 51.62,24.38 47.88,24.38 46.88,25.38 43.12,25.38 42.5,24.75 IC1.27 | T8.1 52.25,27.75 52,27.5 v52,27
  Bottom 0.203: v52,24 v52,27
D25_IO5  (via drill 0.3)
  Top 0.203: R30.1 D14.3 v40.25,32.88 | IC1.4 39.5,16.38 38.88,15.75 v38.88,15.38
  Bottom 0.203: v40.25,32.88 40.5,32.88 47.88,25.5 47.88,15.75 44.38,12.25 41.12,12.25 38.88,14.5 v38.88,15.38
D26_SDA_IMU  (via drill 0.3)
  Top 0.203: IC1.21 44.88,22 45.38,22.5 v46.12,22.5 | IC5.11 31.5,3.62 v34.25,3.62 34.5,3.88 R34.1 | IC2.5 39.1,6.35 v39.12,6.38 | v45.75,6.38 45.75,10.5 43.38,12.88 v43.12,12.88
  Bottom 0.203: v46.12,22.5 45.38,21.75 45.38,13.88 44.25,12.75 43.25,12.75 v43.12,12.88 | v34.25,3.62 36.38,3.62 v39.12,6.38 v45.75,6.38
D27_SCL_IMU  (via drill 0.3)
  Top 0.203: IC1.22 44.75,22.5 45.38,23.12 v45.62,23.12 | IC5.9 33,5 R16.1 v33.25,4.38 | IC2.6 v37.88,7.25 | v46.5,7.25 46.25,7.5 46.25,10.75 44,13 v44,13.38
  Bottom 0.203: v33.25,4.38 36.25,4.38 37.88,6 v37.88,7.25 v46.5,7.25 | v45.62,23.12 44.88,22.38 44.88,15.12 44,14.25 v44,13.38
D28_CS_XB2  (via drill 0.3)
  Top 0.203: IC1.23 44.62,23 45.38,23.75 46,23.75 47.25,22.5 v49.25,22.5 | T8.4 50.5,29.25 v50.5,30.12
  Bottom 0.203: v49.25,22.5 49.25,28 48.75,28.5 48.75,29.62 49.25,30.12 v50.5,30.12
D29_INT_XB2  (via drill 0.3)
  Top 0.203: R18.2 v60.5,13.5 | v50.5,22.62 50,23.12 47.25,23.12 46.25,24.12 45,24.12 44.38,23.5 IC1.24 | v50.5,14.62 50.5,14.12 52,12.62 52,10.5 v53,9.5
  Bottom 0.203: v50.5,22.62 v50.5,14.62 | v53,9.5 56.5,9.5 v60.5,13.5
D30_STATUS_RED  (via drill 0.3)
  Top 0.203: R22.1 5,35.75 5.5,35.25 v5.5,34 | IC1.39 36.75,22.5 36.25,23 34.38,23 33.5,23.88 24.75,23.88 v23.88,23
  Bottom 0.203: v23.88,23 21.5,23 10.5,34 v5.5,34
D31_STATUS_GREEN  (via drill 0.3)
  Top 0.203: R10.1 v3.5,35.38 | IC1.41 36.5,21.5 36,22 31.5,22 v31,21.5
  Bottom 0.203: v31,21.5 30.88,21.38 27.62,21.38 24.5,24.5 21.88,24.5 11,35.38 v3.5,35.38
D32_TX2  (via drill 0.3)
  Top 0.203: v49.5,12.88 49,12.88 47.38,14.5 42.88,14.5 41,16.38 IC1.7 | R37.1 D17.3 v52.75,32.88
  Bottom 0.203: v49.5,12.88 51,12.88 53.12,15 53.12,29.5 52.38,30.25 52.38,32.5 v52.75,32.88
D33_RX2  (via drill 0.3)
  Top 0.203: v49.12,13.75 48.75,13.75 47.62,14.88 43.12,14.88 41.5,16.5 IC1.8 | R38.1 D18.3 v50.25,32.88
  Bottom 0.203: v49.12,13.75 51.25,13.75 52.62,15.12 52.62,29.25 50.25,31.62 v50.25,32.88
GND  (via drill 0.3)
  Top 0.203: IC1.TP 40.75,20.5 40,20.5 v40,19.88 40,21 IC1.42 | 30.88,7 31,7 | C27.1 30.88,7.62 C26.1 | 38.5,22.75 v38.75,22.75 | 45.75,20.5 C24.1 | 57.12,30.38 56,30.38
  Top 0.254: 30.12,5.62 30,5.75 IC5.4 30,7 30.88,7 30.88,7.62 | 30.88,5.62 31,5.75 31,7 | IC1.5 v40,19.88 | IC1.35 38.5,22.75 | 40.75,20.5 IC1.18 45.75,20.5
  other vias: 60,53 40,21.62 41.62,21.62 41.62,19.88 29,34 31.5,34 34,34 36.5,34 39,34 41.5,34 44,34 46.5,34 49,34 51.5,34 58,30.12 8,55 8,64 12,41.62 12.75,40 13.88,38.62 15.38,37.62 15.5,40 17.12,39.12 19,39 21,39 17.25,37.12 19.12,37 21,36.88 17,2 2,5 3.5,2 59,14 84,47 84,39 72,47 58,47 72,39 45,53 27.54,39.99 29,44 29,53 22.62,44.5 17,57 45,44 58,39 66,64 84,56 74.5,24.5 74.5,17.5 74.5,21 74.5,27.5 74.5,14.5 80.5,30.5 79.5,11.5 6.5,30.5 5.5,11.5 29,4.88 31,5.12 38.5,2 42.75,22.75 42.75,18.75 38.75,18.75 22.62,52.5 11.75,49.12 14.38,41.5 14,49.5 13,44.12 12,47.5 14,47.5 12.62,51 11.5,45.5 11.62,43.38 14.5,45.5 14.5,43.5 11.5,24.5 11.5,17.5 11.5,21 11.5,27.5 11.5,14.5 76.5,2 55.5,2 46.5,2 25,2 1.5,41 1.5,37.5 66,2 84.5,5 55,64 77,64 47,64 17,64 18.5,50.5 18.5,46.5 17.5,45.5 17.5,51.5 77,56 33,64 54,47 54,56 57,56 22.75,36.12 22.75,38.5 24.25,37.62 25.62,36.38 24,34.75 24.75,33 26.62,34.62 27,32.62 25,30.88 27.75,30.62 26,29.12 54,34 29.75,30 32,20.38 30.38,14.5 32.25,30 28.12,28.25 37,30 39.75,30.12 14,5.38 49.62,19.75 31.25,8.62 35.75,12.62 25.62,21 21,11.5 61.5,30.5 58.38,25 47.75,28.88 47.88,11.5 58.62,18.88 72,22 68.88,20.5 66.75,21 21,21 17.5,18 66.62,24.5 66.75,28.38 41.75,14.62 49.5,14.62 61.62,19 64.5,9 56.88,11.12 54.5,8.5 34.88,10.12 28.75,9.38 34.12,28.12 31,28.12 21.88,26 67,33.5 57,27.25 66.38,15.5 10.75,7.12 18.5,30.5 52.75,11.75 44.62,10.38 41.12,10.5 12,53.5 7.5,45 9,60.5 15,60.5 27,51.5 37,51.5 27,42.5 37,42.5 43,42.5 43,51.5 53,51.5 65,60.5 75,60.5 82,51.5 72,51.5 68,51.5 58,51.5 72,42.5 68,42.5 82,42.5 58,42.5 53,42.5 4.5,34.5 81.5,8.5 17.5,23.5
  pour Bottom (isolate 0.203): 0,0 86,0 86,5 82,9 82,33 86,37 86,66 0,66 0,37 4,33 4,9 0,5
  pour Top (isolate 0.203, rank 2): 86,0 0,0 0,5 4,9 4,33 0,37 0,66 86,66 86,37 82,33 82,9 86,5
I2C_SCL  (via drill 0.3)
  Top 0.203: I2.4 v66,52.5 | I4.4 R4.1 65,35.88 61.25,32.12 59.38,32.12 58.25,33.25 T5.6 57.75,33.25
  Top 0.406: I4.4 I2.4 | I5.4 I3.4 v80,52.5 77.75,54.75 73.38,54.75 73,55.12 I1.4
  Bottom 0.203: v66,52.5 v80,52.5
I2C_SDA  (via drill 0.3)
  Top 0.203: I1.3 71,55.38 | I4.3 64,36.5 R7.1 63.38,35.38 62.75,34.75 T5.3
  Top 0.406: I5.3 v78,43.5 I3.3 78,52.25 76.75,53.5 72.88,53.5 71,55.38 | I4.3 v64,43.5 I2.3
  Bottom 0.203: v78,43.5 v64,43.5
I2C_VCC  (via drill 0.3)
  Top 0.203: R4.2 67,36.62 v67.12,36.75 | I4.2 v62,36.75 62,36.25 R7.2
  Top 0.406: I4.2 v62,44.62 I2.2 62,54 | I5.2 v76,44.62 I3.2 | 62,54 67.88,54 69,55.12 I1.2 | 62,54 62,54.62 62.5,55.12 R31.2 | C5.2 R31.2 | T2.3 61.35,57.9 62.5,56.75 R31.2
  Bottom 0.203: v76,44.62 v62,44.62 | v67.12,36.75 v62,36.75
IO1  (via drill 0.3)
  Top 0.203: R40.2 30.75,35.62 v31.12,36 33,37.88 IO1.3
  Bottom 0.203: v31.12,36 31.12,52.48 IO.1
IO2  (via drill 0.3)
  Top 0.203: R39.2 33.25,35.62 v33.62,36 35,37.38 IO1.4
  Bottom 0.203: v33.62,36 33.62,52.52 IO.2
IO3  (via drill 0.3)
  Top 0.203: R42.2 35.75,35.62 v36.12,36
  Top 0.406: IO2.3 33,55.69 IO.3
  Bottom 0.203: v36.12,36 36.12,52.56 IO.3
IO4  (via drill 0.3)
  Top 0.203: R41.2 v37.75,37
  Top 0.406: IO2.4 35,56.23 IO.4
  Bottom 0.203: v37.75,37 37.75,53.48 IO.4
IO5  (via drill 0.3)
  Top 0.203: R30.2 39.75,35.62 v39.38,36
  Bottom 0.203: v39.38,36 39.38,54.4 IO.5
IO6  (via drill 0.3)
  Top 0.203: R2.2 42.25,35.62 v41.88,36
  Bottom 0.203: v41.88,36 41.88,54.44 IO.6
MCU_CS_XBEE1  (via drill 0.3)
  Top 0.203: IC3.2 IC3.1 52.08,14.68 51.88,14.88 v51.38,14.88 | T8.6 50.62,27.75 50.62,27.25 | 50.62,27.25 v50.62,27 | R43.1 50.62,27.25
  Bottom 0.203: v51.38,14.88 51.38,22.88 50.62,23.62 v50.62,27
MCU_CS_XBEE2  (via drill 0.3)
  Top 0.203: 53.25,29.25 53.5,29.25 R44.1 53.38,29.25 T8.3 v51.62,29.25 | IC3.17 54.02,19.27 53.75,19 52.75,19 52.73,18.98 | IC3.19 52.73,18.98 | 52.73,18.98 52.5,18.75 v52,18.75
  Bottom 0.203: v51.62,29.25 51.38,29 51.38,23.62 52,23 v52,18.75
N$1
  Top 0.203: IC1.1 38,17.12 37.88,17 36.62,17 36,16.38 35.12,16.38 34.88,16.12 34.88,16 34.5,15.62 Q1.2 34.5,14 C3.1
N$2
  Top 0.203: IC1.2 38.5,16.88 38.25,16.62 37.12,16.62 37,16.5 Q1.1 37,14 C4.2
N$3
  Top 0.203: D3.A R22.2
N$4
  Top 0.406: PWR.2 13,54.8 F2.1
N$5
  Top 0.203: R28.1 D5.A
N$6
  Top 0.203: D6.A R29.1
N$8
  Top 0.203: D8.A R31.1
N$9
  Top 0.203: D9.A R32.1
N$12
  Top 0.203: D4.A R10.2
N$13
  Top 0.203: RESET.3 7.5,35.88 8,35.38 11.38,35.38 12,36 R25.2
  Top 0.406: RESET.2 RESET.3
RST  (via drill 0.3)
  Top 0.203: R25.1 v15,36 | IC1.40 36.62,22 36.12,22.5 v28.5,22.5 28.5,20.88 | 28.5,20.88 28.5,19.88 | 28.5,19.88 28.5,18.5 28.04,18.04 SWD.RST | C1.2 28.5,20.88 | R24.2 28.5,19.88
  Bottom 0.203: v28.5,22.5 v15,36
RST_XB1
  Top 0.203: XBEE1.5 13,6.6 IC7.2
RST_XB2
  Top 0.203: IC6.2 69.08,36.05 69.5,35.62 72,35.62 73,34.62 XBEE2.5
SDO1
  Top 0.203: IC5.17 28.5,2.38 J1.2
SDO2
  Top 0.203: IC5.12 31,3.38 31.88,2.5 J2.2
SHLD
  Top 0.406: USB.SHLD6 USB.SHLD8 USB.SHLD7 USB.SHLD5 USB.SHLD3 7.85,46.15 8.75,45.25 R14.2
  Bottom 0.406: USB.SHLD2 10.55,52.79 9.84,53.5 USB.SHLD4 USB.SHLD3 9.92,46.5 10.55,47.13 USB.SHLD1
SW
  Top 0.203: SW.4 SW.1 R1.2
SWCLK
  Top 0.203: IC1.45 36.62,19.5 36,18.88 33.62,18.88 33.25,19.25 30.75,19.25 28.75,17.25 28.75,14.75 28.23,14.23 SWD.SWCLK 26.48,14.23 26.25,14 26.25,12.5 26.75,12 28.38,12 28.88,11.5 R33.2
SWDIO
  Top 0.203: IC1.46 36.75,19 36.12,18.38 33.38,18.38 33,18.75 31,18.75 29.25,17 29.25,14.12 28.09,12.96 SWD.SWDIO
UART_RX1
  Top 0.203: S1.3 49,37.25 48.25,36.5 47.25,36.5 46.38,35.62 R36.2
UART_RX2  (via drill 0.3)
  Top 0.203: R38.2 51,35.62 v51.38,36
  Top 0.406: S2.3 49,45 v50,44
  Bottom 0.203: v50,44 51.38,42.62 v51.38,36
UART_TX1
  Top 0.203: R35.2 48.25,35.62 49.38,36.75 50.5,36.75 51,37.25 S1.4
UART_TX2  (via drill 0.3)
  Top 0.203: R37.2 52.75,36.75 v53,37 | 51,47 S2.4
  Top 0.406: v52.5,47 51,47
  Bottom 0.203: v53,37 54,38 54,45.5 v52.5,47
UART_VCC
  Top 0.203: C6.2 47,56 | 44.75,56 44.5,55.75 T3.3
  Top 0.406: S1.2 S2.2 47,52.5 48,53.5 48,56 | R32.2 48,56 | 48,56 47,56 44.75,56
USB_D_N
  Top 0.18: USB.D- 11.16,50.65 arc-90 13.18,48.62 13.18,46.27 D1.1 | 13.45,46.05 13.75,45.75 13.75,43.88 arc-90 13.5,43.62 arc90 13.18,43.31 13.18,43 arc90 18,38.18 20,38.18 arc-90 26.18,32 arc90 29,29.18 36.62,29.18 arc-90 39.43,26.38 39.43,24.22 arc90 IC1.33
  Top 0.203: D1.1 13.45,46.05
USB_D_P
  Top 0.18: USB.D+ 11.44,50 arc-90 12.82,48.62 12.82,46.27 D1.2 | 12.55,46.05 12.25,45.75 12.25,43.88 arc90 12.5,43.62 arc-90 12.82,43.31 12.82,43 arc90 18,37.82 20,37.82 arc-90 25.82,32 arc90 29,28.82 36.62,28.82 arc-90 39.07,26.38 39.07,24.22 arc-90 IC1.34
  Top 0.203: D1.2 12.55,46.05
VBUS
  Top 0.406: USB.VBUS 11.43,51.3 12.38,52.25 F1.1
VCCANA
  Top 0.254: L1.2 40.75,12.43 C12.2 C22.2 C16.2 40.75,15.88 40.5,16.12 IC1.6
VCCCORE
  Top 0.254: IC1.43 35.5,20.5 C21.2
XB1_CS  (via drill 0.3)
  Top 0.203: v35,25.75 25,25.75 23.88,26.88 18.5,26.88 | v42.25,26.12 42.38,26.25 47.25,26.25 48.38,25.12 53.75,25.12 v53.75,24.88 | 18.5,26.88 18.5,27 17.88,27.62 13.38,27.62 11,30 XBEE1.17 | 18.5,26.88 R46.1 | IC3.18 53.38,20.75 v53.75,21.12
  Bottom 0.203: v53.75,24.88 v53.75,21.12 | v35,25.75 41,25.75 41.38,26.12 v42.25,26.12
XB1_MISO  (via drill 0.3)
  Top 0.203: XBEE1.4 v12,11.5 | IC3.8 56.62,13.12 v57,12.75
  Bottom 0.203: v12,11.5 13.5,10 22,10 25,7 35.5,7 37,8.5 49.5,8.5 52,11 55.25,11 v57,12.75
XB1_MOSI  (via drill 0.3)
  Top 0.203: v35.88,27.62 34.62,27.62 34.5,27.5 26,27.5 23,30.5 XBEE1.11 | v42.12,27.62 v47.38,27.62 | v49,18.88 49.75,18.12 53.62,18.12 54.67,19.18 IC3.16
  Bottom 0.203: v42.12,27.62 41.88,27.88 40.88,27.88 40.62,27.62 v35.88,27.62 | v49,18.88 48.62,19.25 48.62,26.38 v47.38,27.62
XB1_RX
  Top 0.203: XBEE1.3 10.5,8.5 13.5,11.5 13.5,17.25 21,24.75 R12.2
XB1_SCK  (via drill 0.3)
  Top 0.203: v35.88,26.38 25.38,26.38 24.25,27.5 19,27.5 18.12,28.38 v14,28.38 | v42.75,26.88 47.25,26.88 48.62,25.5 56,25.5 v56.5,25 | IC3.14 55.98,20.85 56.75,21.62 56.75,22.12 v56.5,22.38 | XBEE1.18 v9.88,30.5
  Bottom 0.203: v56.5,22.38 v56.5,25 | v42.75,26.88 41.88,26.88 41.62,26.62 41.12,26.62 40.88,26.38 v35.88,26.38 | v9.88,30.5 11.88,30.5 v14,28.38
XB1_TX  (via drill 0.3)
  Top 0.203: XBEE1.2 v8,11.5 | v14.5,15.5 14,16 14,17.12 20.25,23.38 R11.2
  Bottom 0.203: v8,11.5 9.88,11.5 11.38,13 13,13 14.5,14.5 v14.5,15.5
XB1_VCC  (via drill 0.3)
  Top 0.203: 22.9,16.43 T7.3 | R46.2 v16,26.5 | 6.8,6.75 C14.2 7,6.75 7.88,6.75 | 9.25,5.38 IC7.3 | R28.2 v24,15.5 23,15.5 | 21,15.5 C15.2 | T8.2 52.88,28.5 53.88,27.5 v54.38,27.5
  Top 0.406: XBEE1.1 C2.2 6.8,6.75 | 7.88,6.75 9.25,5.38 11.62,3 14,3 15,4 15,9 17,11 17,13 v19.5,15.5 21,15.5 23,15.5 | T7.3 23,15.5 | 23,15.5 R15.1
  Bottom 0.203: v16,26.5 19.5,23 v19.5,15.5 | v24,15.5 25.38,15.5 32.75,8.12 35.12,8.12 36.5,9.5 48.25,9.5 53.62,14.88 53.62,19.88 54.38,20.62 v54.38,27.5
XB2_CS  (via drill 0.3)
  Top 0.203: IC3.3 53.38,13.25 53.25,13.12 53.25,12.25 56,9.5 v56,8 | XBEE2.17 v75,10 75,12 73.5,13.5 R45.1
  Bottom 0.203: v56,8 73,8 v75,10
XB2_MISO
  Top 0.203: XBEE2.4 74.5,30.5 64.12,20.12 58,20.12 57.92,20.05 IC3.11
XB2_MOSI
  Top 0.203: IC3.7 55.98,12.65 56.62,12 61.38,12 63,10.38 XBEE2.11
XB2_RX  (via drill 0.3)
  Top 0.203: XBEE2.3 v76,33.5 | R20.2 64.38,16 65.38,17 70.38,17 v71,17.62
  Bottom 0.203: v76,33.5 75.5,33.5 71,29 v71,17.62
XB2_SCK
  Top 0.203: 77,9 XBEE2.18 77,7.38 76.12,6.5 60,6.5 54.67,11.82 IC3.5
XB2_TX  (via drill 0.3)
  Top 0.203: XBEE2.2 v78,30.5 | v73,20.75 69.75,17.5 R21.2
  Bottom 0.203: v78,30.5 75.5,30.5 73,28 v73,20.75
XB2_VCC  (via drill 0.3)
  Top 0.203: T8.5 51,28.5 51.38,28.12 51.38,26.75 51.75,26.38 60.38,26.38 R29.2 63,26.5 | 82.2,35.25 C18.2 | v79,35.25 73.75,35.25 72,37 IC6.3 | R45.2 v69,13.5 | C19.2 65,26.5
  Top 0.406: XBEE2.1 C17.2 | C17.2 82.2,35.25 | C17.2 v79,35.25 | R19.1 63,26.5 | 63,26.5 T6.3 | 63,26.5 65,26.5 v68,26.5
  Bottom 0.203: v68,26.5 68,14.5 v69,13.5
  Bottom 0.406: v68,26.5 68,29.12 74.12,35.25 v79,35.25
XBEE1_CTS/IRQ
  Top 0.203: XBEE1.12 21,29.38 21.88,28.5 R13.1
XBEE2_CTS/IRQ
  Top 0.203: XBEE2.12 65,12.88 64.38,13.5 R18.1

### Text on the board
tPlace: GND | 5V | GND | 5V | 1 | 2 | 3 | 4 | 5 | 6 | GND | 5V | SDA | SCL | 2 | 2 | GND | 5V | IO | IO | GND | 5V | Rx | Tx | GND | 5V | SDA | SCL | GND | 5V | SDA | SCL | Digital | UART/Serial | I2C/Wire | Reset | 1 | 1 | 1 | 20 | Open | Hardware | SAMD21G18 | SWD | o | o | 20 | 1 | BMX055 | senseBox MCU | SW | ATECC | Rev 1.1
bPlace: www.sensebox.de | Designed by | Watterott electronic
Reference: Silkscreen: 21 tPlace + 22 bPlace
tDocu: SDO1 | SDO2